# EasyEDA Pro project 各种板子.eprj

# Schematic Schematic1
Create Date: 2023-07-29; Page Name: P1; Project Name: 各种板子; Schematic Name: Schematic1; Update Date: 2023-07-30; Company: 嘉立创EDA; Page Size: A4; Version: V1.0
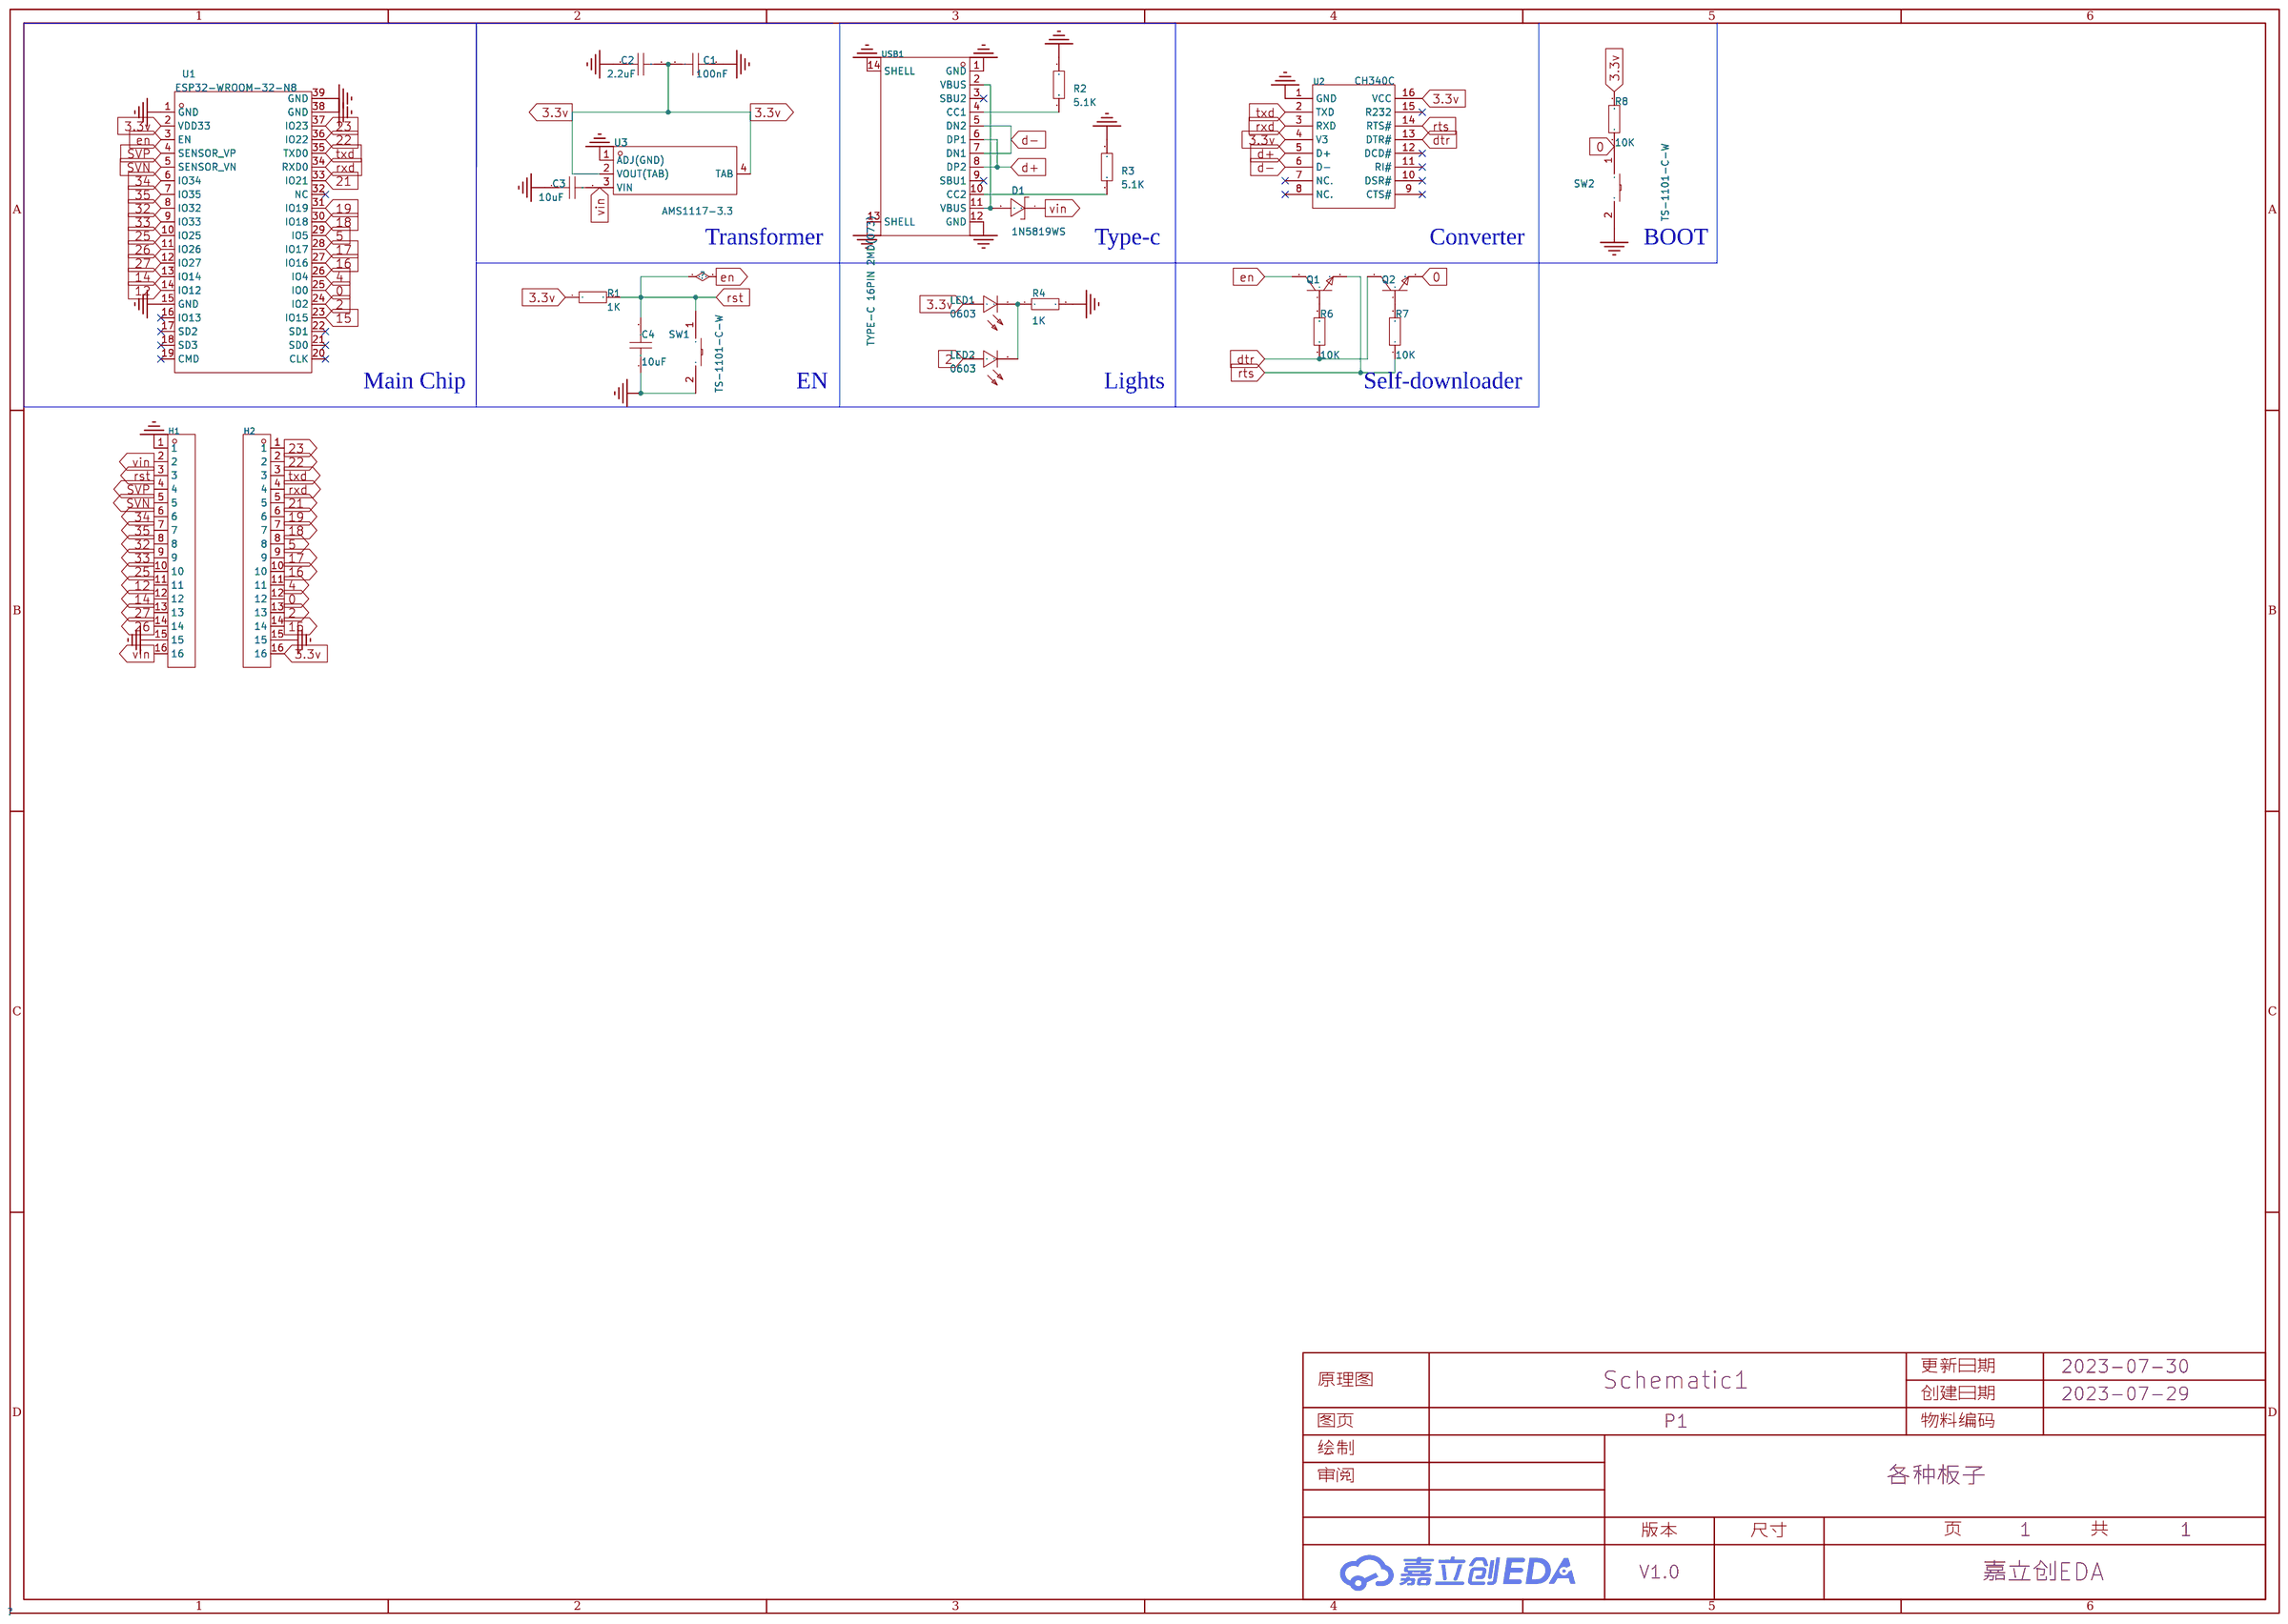
[diagram p0: schematic sheet]

## Parts
C1  100nF  [C0603]
C2  2.2uF  [C0603]
C3  10uF  [C0603]
C4  10uF  [C0603]
D1  1N5819WS  [SOD-323_L1.8-W1.3-LS2.5-RD]
H1  PZ254-1-16-Z-8.5  [HDR-TH_16P-P2.54-V-M]
H2  PZ254-1-16-Z-8.5  [HDR-TH_16P-P2.54-V-M]
LED1  0603  [LED0603-RD_RED]
LED2  0603  [LED0603-RD_RED]
Q1  S8050  [SOT-23-3_L2.9-W1.6-P1.90-LS2.8-BR]
Q2  S8050  [SOT-23-3_L2.9-W1.6-P1.90-LS2.8-BR]
R1  1K  [R0603]
R2  5.1K  [R0603]
R3  5.1K  [R0603]
R4  1K  [R0603]
R6  10K  [R0603]
R7  10K  [R0603]
R8  10K  [R0603]
SW1  TS-1101-C-W  [SW-SMD_L6.0-W3.3-LS8.0]
SW2  TS-1101-C-W  [SW-SMD_L6.0-W3.3-LS8.0]
U1  ESP32-WROOM-32-N8  [WIFIM-SMD_39P-L25.5-W18.0-P1.27]
U2  CH340C  [SOP-16_L10.0-W3.9-P1.27-LS6.0-BL]
U3  AMS1117-3.3  [SOT-223-4_L6.5-W3.5-P2.30-LS7.0-BR]
USB1  TYPE-C 16PIN 2MD(073)  [USB-C-SMD_TYPE-C-6PIN-2MD-073]

## Library data of the parts
C1-C4 = CAP_0603: Supplier Footprint: 0603
D1 = 1N5819WS_C191023: 直流反向耐压(Vr):40V;平均整流电流(Io):1A;正向压降(Vf):600mV@1A;; LCSC Part Name: 40V 1A 600mV@1A; Supplier Part: C191023; Manufacturer: Hottech(合科泰); Supplier Footprint: SOD-323; JLCPCB Part Class: 基础库; Datasheet: https://atta.szlcsc.com/upload/public/pdf/source/20220428/3CB86FD8D28D653594B4E35F9D5AEFD9.pdf; Supplier: LCSC; Reverse Voltage (Vr): 40V; Average Rectified Current (Io): 1A; Forward Voltage (Vf@If): 600mV@1A
H1 H2 = PZ254-1-16-Z-8.5_C2894939: 排数:单排;总PIN位数:16;间距:2.54mm;插针结构:1x16P;行距:-;安装类型:直插;圆针/方针:方针;额定电流:3A;额定电压:-;配合针长度:6mm;塑高:2.5mm;端接针长度:3mm;触头材质:-;工作温度范围:-40℃~+105℃;颜色:黑色;; LCSC Part Name: 2.54mm 1x16P 直插 方针; Supplier Part: C2894939; Manufacturer: HCTL(华灿天禄); Supplier Footprint: 直插,P=2.54mm; JLCPCB Part Class: 扩展库; Supplier: LCSC; Number of Rows: 单排; Number of Pins: 16; Pitch: 2.54mm; Pin Structure: 1x16P; Mounting Type: 直插; Circluar Pins/Square Pins: 方针; Current Rating (Max): 3A; Length of Mating Pin: 6mm; Insulation Height: 2.5mm; Length of End Connection Pin: 3mm; Operating Temperature Range: -40℃~+105℃; Color: 黑色
LED1 LED2 = NCD0603R1_C84263: 发光颜色:红灯;; LCSC Part Name: 红灯; Supplier Part: C84263; Manufacturer: 国星光电; JLCPCB Part Class: 扩展库; Datasheet: https://atta.szlcsc.com/upload/public/pdf/source/20200820/C84263_DABC6A75E58F576973B407FDBA283D60.pdf; Supplier: LCSC; Emitted Color: 红灯
Q1 Q2 = S8050_C105433: 晶体管类型:NPN;集射极击穿电压(Vceo):25V;集电极电流(Ic):500mA;功率(Pd):300mW;直流电流增益(hFE@Ic,Vce):120@50mA,1V;; LCSC Part Name: NPN 25V 500mA L档 120-200; Supplier Part: C105433; Manufacturer: CJ(江苏长电/长晶); Supplier Footprint: SOT-23; JLCPCB Part Class: 扩展库; Datasheet: https://atta.szlcsc.com/upload/public/pdf/source/20170415/1492237762328.pdf; Supplier: LCSC; Transistor Type: NPN; Collector-Emitter Breakdown Voltage (Vceo): 25V; Collector Current (Ic): 500mA; Power Dissipation (Pd): 300mW; Collector Cut-Off Current (Icbo): 100nA; Collector-Emitter Saturation Voltage (VCE(sat)@Ic,Ib): 600mV@500mA,50mA; DC Current Gain (hFE@Ic,Vce): 120@50mA,1V; Transition Frequency (fT): 150MHz; Operating Temperature: +150℃@(Tj)
R1-R4 R6-R8 = Res_0603: Supplier Footprint: 0603
SW1 SW2 = TS-1101-C-W: 触点电流:50mA;额定电压(AC):-;额定电压(DC):12V;额定功率:-;绝缘电阻:-;电路结构:单刀单掷;安装方式:立贴;带灯:无;作用力:260gf;机械寿命:5万次;带支架:否;; LCSC Part Name: 立贴 6*3.6*2.5mm 轻触开关 一型3*6*2.5有白ZD b拉伸白色带淡绿按键 卷装; Supplier Part: C318938; Manufacturer: XKB Connectivity(中国星坤); Supplier Footprint: SMD; JLCPCB Part Class: 扩展库; Datasheet: https://atta.szlcsc.com/upload/public/pdf/source/20200227/C318938_C2E53B1EEDE37D980A33616AC086DE53.pdf; Supplier: LCSC; Contact Current: 50mA; Voltage Rating (DC): 12V; Circuit: 单刀单掷; Mounting Style: 立贴; Actuator Style: 矩形按钮; Actuator/Cap Color: 白色带淡绿; With Lamp: 无; Operating Force: 260gf; Mechanical Life: 5万次; Operating Temperature: -30℃~+85℃; Switch Length: 6mm; Switch Width: 3.6mm; Switch Height: 2.5mm; Strike Gundam: 否
U1 = ESP32-WROOM-32-N8: Supplier Part: C529582; Manufacturer: ESPRESSIF(乐鑫); Supplier Footprint: SMD,18x25.5mm; JLCPCB Part Class: 扩展库; Datasheet: https://atta.szlcsc.com/upload/public/pdf/source/20200521/C529581_8F7B9F041ADB7CF235FBC8D159B9C4FF.pdf; Supplier: LCSC
U2 = CH340C: 应用功能:收发器;接口协议:USB 2.0;数据速率:2Mbps;; LCSC Part Name: CH340C USB转串口芯片 CH340; Supplier Part: C84681; Manufacturer: WCH(南京沁恒); Supplier Footprint: SOP-16; JLCPCB Part Class: 扩展库; Datasheet: https://atta.szlcsc.com/upload/public/pdf/source/20200819/C84681_ADBED554CE321879DBD6B1D06488689C.pdf; Supplier: LCSC; Applications Function: 收发器; Protocol: USB 2.0; Data Rate: 2Mbps; Supply Voltage: 3.3V；5V
U3 = AMS1117-3.3_C347222: 输出类型:固定;输出极性:正;最大输入电压:18V;输出电压:3.3V;输出电流:1A;电源纹波抑制比(PSRR):60dB@(120Hz);; Supplier Part: C347222; Manufacturer: UMW(广东友台半导体); Supplier Footprint: SOT-223; JLCPCB Part Class: 扩展库; Datasheet: https://atta.szlcsc.com/upload/public/pdf/source/20211011/50CC665C22E3A66C08379A4A74BDA25C.pdf; Supplier: LCSC; Output Type: 固定; Output Polarity: 正; Number of Outputs: 1; Maximum Input Voltage: 18V; Output Voltage: 3.3V; Dropout Voltage: 1.3V@(1A); Output Current: 1A; Power Supply Rejection Ratio (PSRR): 60dB@(120Hz)
USB1 = TYPE-C 16PIN 2MD(073): 连接器类型:Type-C;标准:-;公母:母座;触点数量:16;端口数量:1;安装方式:卧贴;额定电流 - 电源:5A;工作温度范围:-25℃~+85℃;; LCSC Part Name: TYPE-C母座 16P 4脚插件带定位柱 不锈钢外壳 2次模顶; Supplier Part: C2765186; Manufacturer: SHOU HAN(首韩); Supplier Footprint: SMD; JLCPCB Part Class: 扩展库; Supplier: LCSC; Connector Type: Type-C; Gender: 母座; Number of Contacts: 16; Number of Ports: 1; Mounting Style: 卧贴; Current Rating - Power (Max): 5A; Operating Temperature Range: -25℃~+85℃

## Nets
3.3v: C1.2 C2.1 H2.16 LED1.2(A) R1.1 R8.2 U1.2(VDD33) U2.4(V3) U2.16(VCC) U3.2(VOUT(TAB)) U3.4(TAB)
GND: C1.1 C2.2 C3.1 C4.1 H1.1 H1.15 H2.15 R2.1 R3.1 R4.2 SW1.2 SW2.2 U1.1(GND) U1.15(GND) U1.38(GND) U1.39(GND) U2.1(GND) U3.1(ADJ(GND)) USB1.1(GND) USB1.12(GND) USB1.13(SHELL) USB1.14(SHELL)
vin: C3.2 D1.1(C) H1.2 H1.16 U3.3(VIN)
0: H2.12 Q2.2 R8.1 SW2.1 U1.25(IO0)
2: H2.13 LED2.2(A) U1.24(IO2)
4: H2.11 U1.26(IO4)
5: H2.8 U1.29(IO5)
12: H1.11 U1.14(IO12)
14: H1.12 U1.13(IO14)
15: H2.14 U1.23(IO15)
16: H2.10 U1.27(IO16)
17: H2.9 U1.28(IO17)
18: H2.7 U1.30(IO18)
19: H2.6 U1.31(IO19)
21: H2.5 U1.33(IO21)
22: H2.2 U1.36(IO22)
23: H2.1 U1.37(IO23)
25: H1.10 U1.10(IO25)
26: H1.14 U1.11(IO26)
27: H1.13 U1.12(IO27)
32: H1.8 U1.8(IO32)
33: H1.9 U1.9(IO33)
34: H1.6 U1.6(IO34)
35: H1.7 U1.7(IO35)
d+: U2.5(D+) USB1.6(DP1) USB1.8(DP2)
d-: U2.6(D-) USB1.5(DN2) USB1.7(DN1)
dtr: Q2.3 R6.1 U2.13(DTR#)
en: C4.2 H1.3 Q1.3 R1.2 SW1.1 U1.3(EN)
rts: Q1.2 R7.1 U2.14(RTS#)
rxd: H2.4 U1.34(RXD0) U2.3(RXD)
SVN: H1.5 U1.5(SENSOR_VN)
SVP: H1.4 U1.4(SENSOR_VP)
txd: H2.3 U1.35(TXD0) U2.2(TXD)
$1N2818: R2.2 USB1.4(CC1)
$1N3069: D1.2(A) USB1.2(VBUS) USB1.11(VBUS)
$1N3084: R3.2 USB1.10(CC2)
$1N3978: Q2.1 R7.2
$1N4007: Q1.1 R6.2
$1N5108: LED1.1(K) LED2.1(K) R4.1

Not connected (* = marked no-connect by the designer): U1 16(IO13)* 17(SD2)* 18(SD3)* 19(CMD)* 20(CLK)* 21(SD0)* 22(SD1)* 32(NC)*; U2 7(NC.)* 8(NC.)* 9(CTS#)* 10(DSR#)* 11(RI#)* 12(DCD#)* 15(R232)*; USB1 3(SBU2)* 9(SBU1)*

## Notes on the sheet
- Transformer
- Type-c
- Converter
- BOOT
- Main Chip
- EN
- Lights
- Self-downloader

# Schematic Schematic2
Create Date: 2023-07-29; Page Name: P1; Project Name: 各种板子; Schematic Name: Schematic2; Update Date: 2023-07-30; Company: 嘉立创EDA; Page Size: A4; Version: V1.0
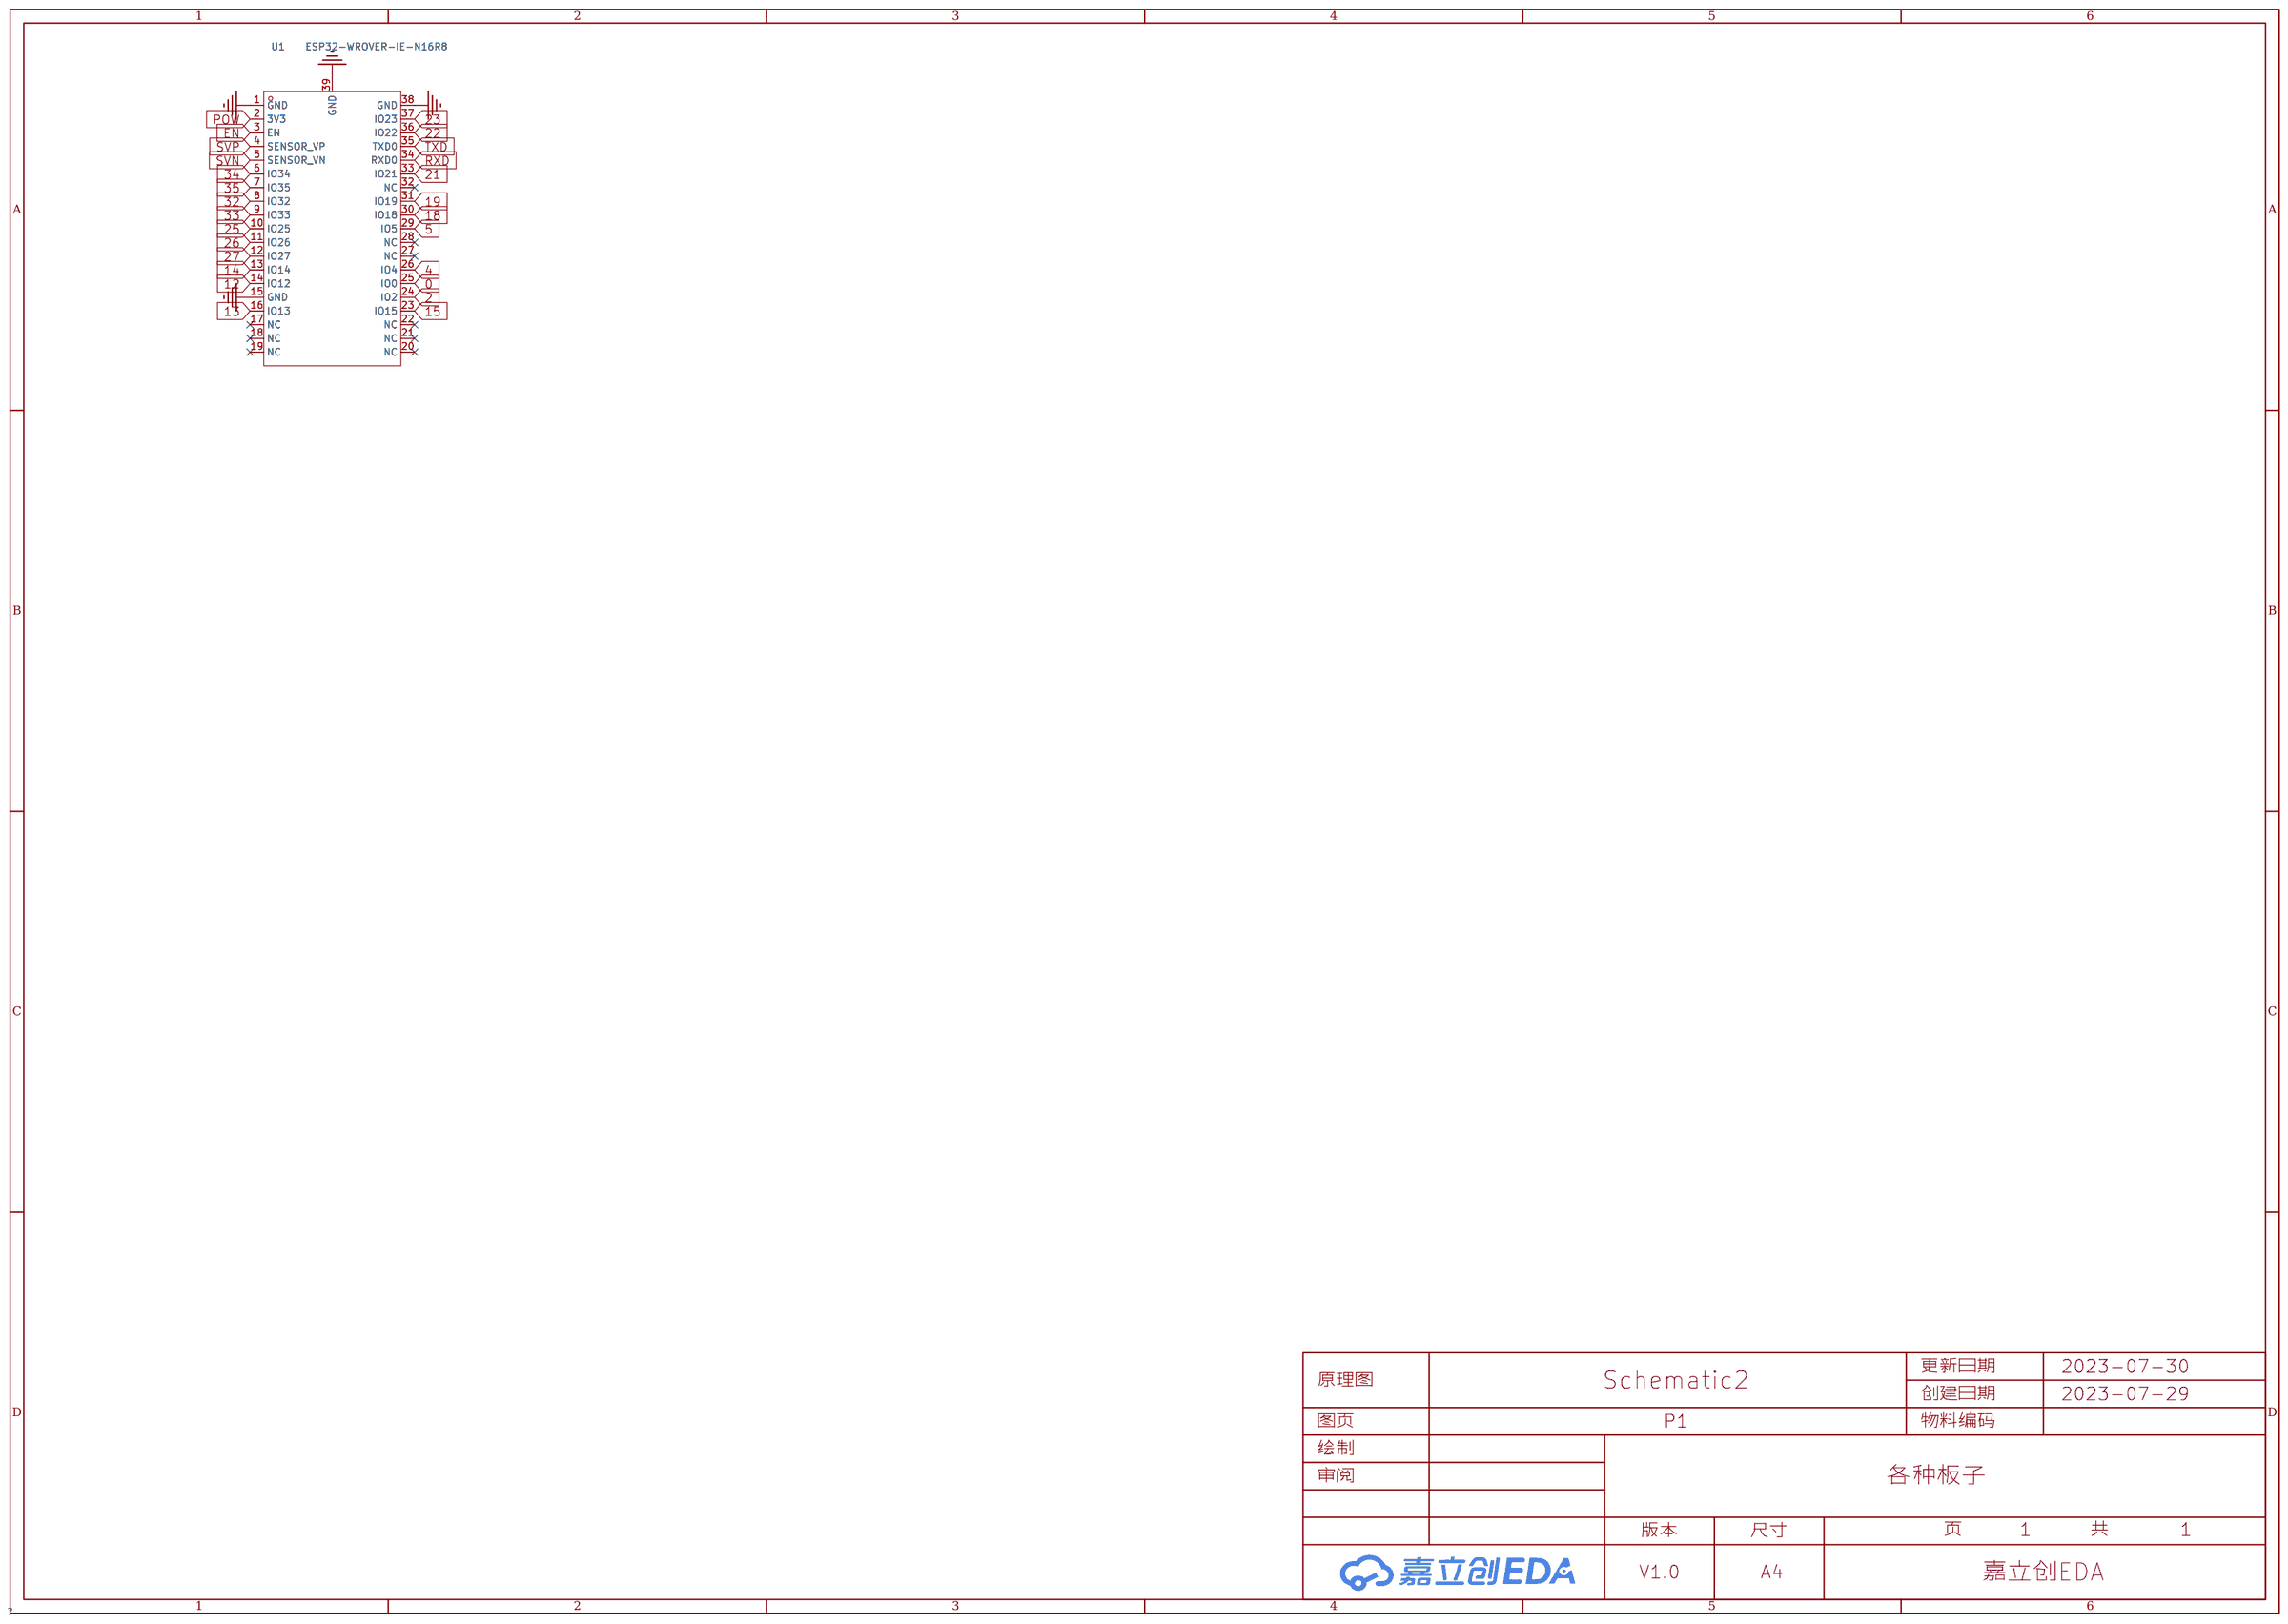
[diagram p1: schematic sheet]

## Parts
U1  ESP32-WROVER-IE-N16R8  [WIFI-SMD_ESP32-WROVER-E]

## Library data of the parts
U1 = ESP32-WROVER-IE-N16R8_C701352: ESP32-WROVER-IE 集成 ESP32-D0WD-V3 芯片 18x31.4x3.3; LCSC Part Name: WIFI模块 外接天线IPEX模组; Supplier Part: C701352; Manufacturer: ESPRESSIF(乐鑫); Supplier Footprint: SMD-38P; JLCPCB Part Class: 扩展库; Datasheet: https://atta.szlcsc.com/upload/public/pdf/source/20200730/C701352_037A60005F1BF393F126A44EB320B018.pdf; Supplier: LCSC

## Nets
GND: U1.1(GND) U1.15(GND) U1.38(GND) U1.39(GND)
0: U1.25(IO0)
2: U1.24(IO2)
4: U1.26(IO4)
5: U1.29(IO5)
12: U1.14(IO12)
13: U1.16(IO13)
14: U1.13(IO14)
15: U1.23(IO15)
18: U1.30(IO18)
19: U1.31(IO19)
21: U1.33(IO21)
22: U1.36(IO22)
23: U1.37(IO23)
25: U1.10(IO25)
26: U1.11(IO26)
27: U1.12(IO27)
32: U1.8(IO32)
33: U1.9(IO33)
34: U1.6(IO34)
35: U1.7(IO35)
EN: U1.3(EN)
POW: U1.2(3V3)
RXD: U1.34(RXD0)
SVN: U1.5(SENSOR_VN)
SVP: U1.4(SENSOR_VP)
TXD: U1.35(TXD0)

Not connected (* = marked no-connect by the designer): U1 17(NC)* 18(NC)* 19(NC)* 20(NC)* 21(NC)* 22(NC)* 27(NC)* 28(NC)* 32(NC)*

# Schematic Schematic1_1
Create Date: 2023-07-29; Page Name: P1; Project Name: 各种板子; Schematic Name: Schematic1; Update Date: 2023-07-30; Company: 嘉立创EDA; Page Size: A4; Version: V1.0
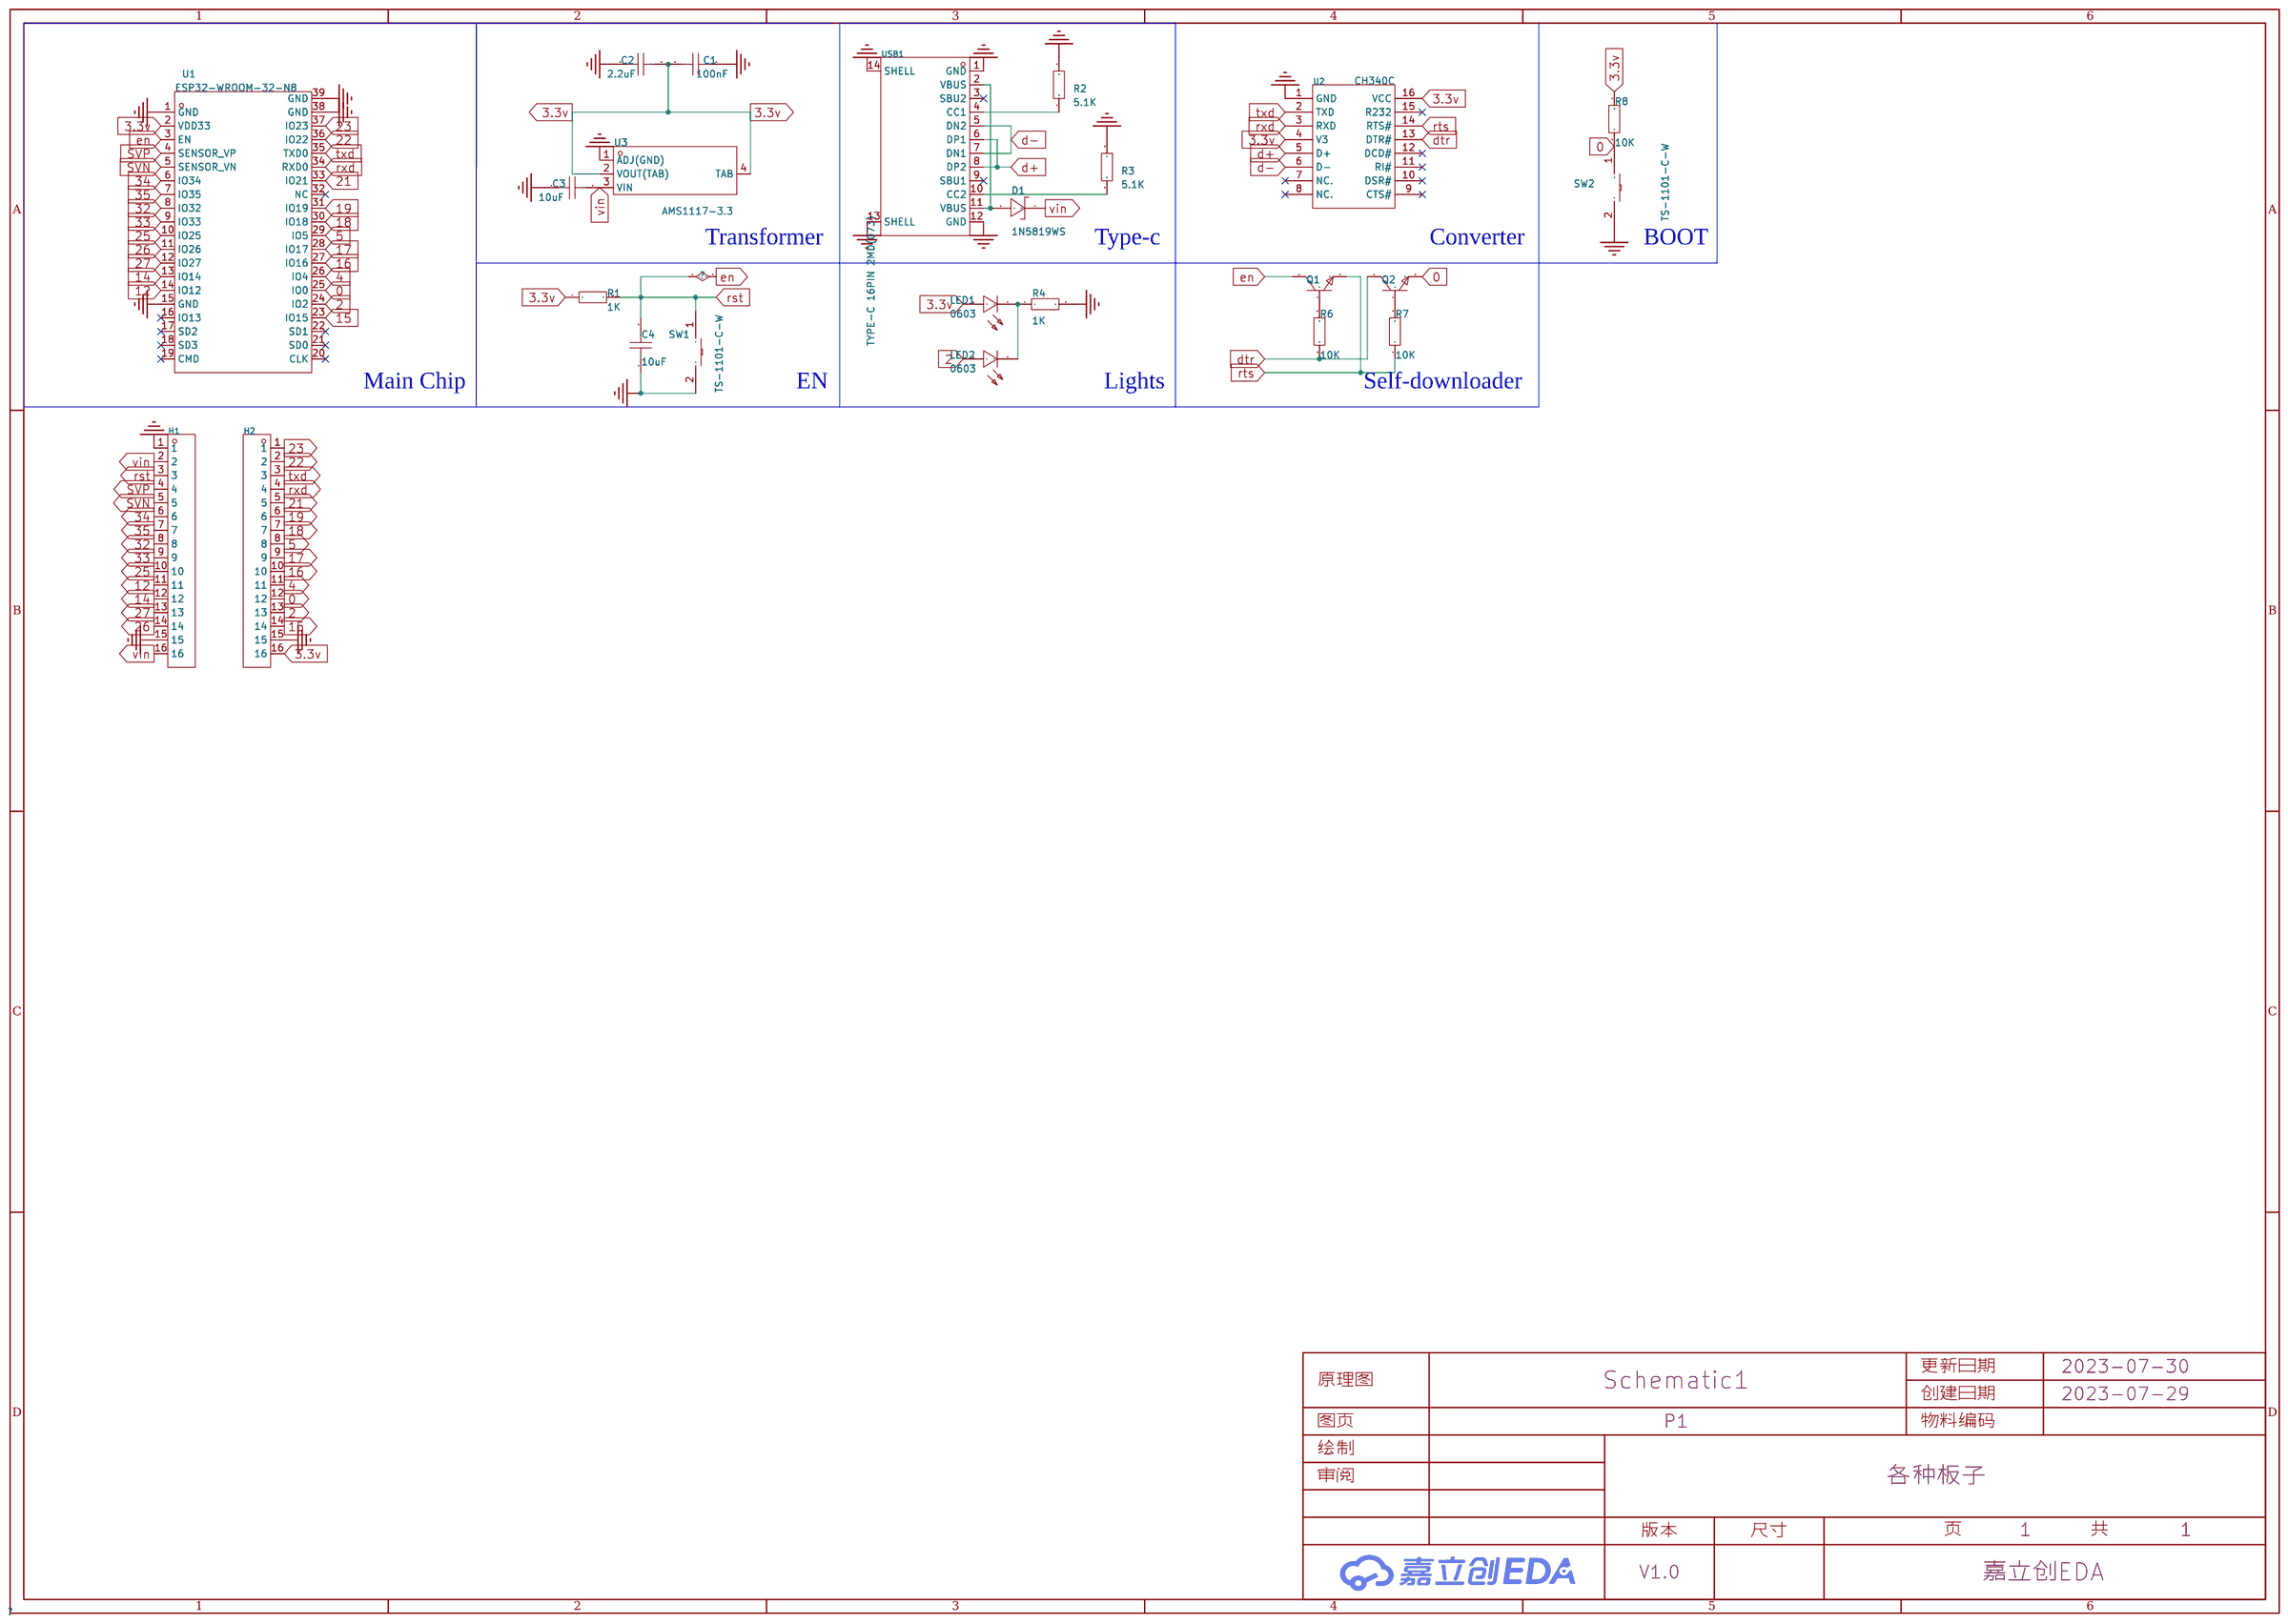
[diagram p2: schematic sheet]

## Parts
C1  100nF  [C0603]
C2  2.2uF  [C0603]
C3  10uF  [C0603]
C4  10uF  [C0603]
D1  1N5819WS  [SOD-323_L1.8-W1.3-LS2.5-RD]
H1  PZ254-1-16-Z-8.5  [HDR-TH_16P-P2.54-V-M]
H2  PZ254-1-16-Z-8.5  [HDR-TH_16P-P2.54-V-M]
LED1  0603  [LED0603-RD_RED]
LED2  0603  [LED0603-RD_RED]
Q1  S8050  [SOT-23-3_L2.9-W1.6-P1.90-LS2.8-BR]
Q2  S8050  [SOT-23-3_L2.9-W1.6-P1.90-LS2.8-BR]
R1  1K  [R0603]
R2  5.1K  [R0603]
R3  5.1K  [R0603]
R4  1K  [R0603]
R6  10K  [R0603]
R7  10K  [R0603]
R8  10K  [R0603]
SW1  TS-1101-C-W  [SW-SMD_L6.0-W3.3-LS8.0]
SW2  TS-1101-C-W  [SW-SMD_L6.0-W3.3-LS8.0]
U1  ESP32-WROOM-32-N8  [WIFIM-SMD_39P-L25.5-W18.0-P1.27]
U2  CH340C  [SOP-16_L10.0-W3.9-P1.27-LS6.0-BL]
U3  AMS1117-3.3  [SOT-223-4_L6.5-W3.5-P2.30-LS7.0-BR]
USB1  TYPE-C 16PIN 2MD(073)  [USB-C-SMD_TYPE-C-6PIN-2MD-073]

## Library data of the parts
C1-C4 = CAP_0603: Supplier Footprint: 0603
D1 = 1N5819WS_C191023: 直流反向耐压(Vr):40V;平均整流电流(Io):1A;正向压降(Vf):600mV@1A;; LCSC Part Name: 40V 1A 600mV@1A; Supplier Part: C191023; Manufacturer: Hottech(合科泰); Supplier Footprint: SOD-323; JLCPCB Part Class: 基础库; Datasheet: https://atta.szlcsc.com/upload/public/pdf/source/20220428/3CB86FD8D28D653594B4E35F9D5AEFD9.pdf; Supplier: LCSC; Reverse Voltage (Vr): 40V; Average Rectified Current (Io): 1A; Forward Voltage (Vf@If): 600mV@1A
H1 H2 = PZ254-1-16-Z-8.5_C2894939: 排数:单排;总PIN位数:16;间距:2.54mm;插针结构:1x16P;行距:-;安装类型:直插;圆针/方针:方针;额定电流:3A;额定电压:-;配合针长度:6mm;塑高:2.5mm;端接针长度:3mm;触头材质:-;工作温度范围:-40℃~+105℃;颜色:黑色;; LCSC Part Name: 2.54mm 1x16P 直插 方针; Supplier Part: C2894939; Manufacturer: HCTL(华灿天禄); Supplier Footprint: 直插,P=2.54mm; JLCPCB Part Class: 扩展库; Supplier: LCSC; Number of Rows: 单排; Number of Pins: 16; Pitch: 2.54mm; Pin Structure: 1x16P; Mounting Type: 直插; Circluar Pins/Square Pins: 方针; Current Rating (Max): 3A; Length of Mating Pin: 6mm; Insulation Height: 2.5mm; Length of End Connection Pin: 3mm; Operating Temperature Range: -40℃~+105℃; Color: 黑色
LED1 LED2 = NCD0603R1_C84263: 发光颜色:红灯;; LCSC Part Name: 红灯; Supplier Part: C84263; Manufacturer: 国星光电; JLCPCB Part Class: 扩展库; Datasheet: https://atta.szlcsc.com/upload/public/pdf/source/20200820/C84263_DABC6A75E58F576973B407FDBA283D60.pdf; Supplier: LCSC; Emitted Color: 红灯
Q1 Q2 = S8050_C105433: 晶体管类型:NPN;集射极击穿电压(Vceo):25V;集电极电流(Ic):500mA;功率(Pd):300mW;直流电流增益(hFE@Ic,Vce):120@50mA,1V;; LCSC Part Name: NPN 25V 500mA L档 120-200; Supplier Part: C105433; Manufacturer: CJ(江苏长电/长晶); Supplier Footprint: SOT-23; JLCPCB Part Class: 扩展库; Datasheet: https://atta.szlcsc.com/upload/public/pdf/source/20170415/1492237762328.pdf; Supplier: LCSC; Transistor Type: NPN; Collector-Emitter Breakdown Voltage (Vceo): 25V; Collector Current (Ic): 500mA; Power Dissipation (Pd): 300mW; Collector Cut-Off Current (Icbo): 100nA; Collector-Emitter Saturation Voltage (VCE(sat)@Ic,Ib): 600mV@500mA,50mA; DC Current Gain (hFE@Ic,Vce): 120@50mA,1V; Transition Frequency (fT): 150MHz; Operating Temperature: +150℃@(Tj)
R1-R4 R6-R8 = Res_0603: Supplier Footprint: 0603
SW1 SW2 = TS-1101-C-W: 触点电流:50mA;额定电压(AC):-;额定电压(DC):12V;额定功率:-;绝缘电阻:-;电路结构:单刀单掷;安装方式:立贴;带灯:无;作用力:260gf;机械寿命:5万次;带支架:否;; LCSC Part Name: 立贴 6*3.6*2.5mm 轻触开关 一型3*6*2.5有白ZD b拉伸白色带淡绿按键 卷装; Supplier Part: C318938; Manufacturer: XKB Connectivity(中国星坤); Supplier Footprint: SMD; JLCPCB Part Class: 扩展库; Datasheet: https://atta.szlcsc.com/upload/public/pdf/source/20200227/C318938_C2E53B1EEDE37D980A33616AC086DE53.pdf; Supplier: LCSC; Contact Current: 50mA; Voltage Rating (DC): 12V; Circuit: 单刀单掷; Mounting Style: 立贴; Actuator Style: 矩形按钮; Actuator/Cap Color: 白色带淡绿; With Lamp: 无; Operating Force: 260gf; Mechanical Life: 5万次; Operating Temperature: -30℃~+85℃; Switch Length: 6mm; Switch Width: 3.6mm; Switch Height: 2.5mm; Strike Gundam: 否
U1 = ESP32-WROOM-32-N8: Supplier Part: C529582; Manufacturer: ESPRESSIF(乐鑫); Supplier Footprint: SMD,18x25.5mm; JLCPCB Part Class: 扩展库; Datasheet: https://atta.szlcsc.com/upload/public/pdf/source/20200521/C529581_8F7B9F041ADB7CF235FBC8D159B9C4FF.pdf; Supplier: LCSC
U2 = CH340C: 应用功能:收发器;接口协议:USB 2.0;数据速率:2Mbps;; LCSC Part Name: CH340C USB转串口芯片 CH340; Supplier Part: C84681; Manufacturer: WCH(南京沁恒); Supplier Footprint: SOP-16; JLCPCB Part Class: 扩展库; Datasheet: https://atta.szlcsc.com/upload/public/pdf/source/20200819/C84681_ADBED554CE321879DBD6B1D06488689C.pdf; Supplier: LCSC; Applications Function: 收发器; Protocol: USB 2.0; Data Rate: 2Mbps; Supply Voltage: 3.3V；5V
U3 = AMS1117-3.3_C347222: 输出类型:固定;输出极性:正;最大输入电压:18V;输出电压:3.3V;输出电流:1A;电源纹波抑制比(PSRR):60dB@(120Hz);; Supplier Part: C347222; Manufacturer: UMW(广东友台半导体); Supplier Footprint: SOT-223; JLCPCB Part Class: 扩展库; Datasheet: https://atta.szlcsc.com/upload/public/pdf/source/20211011/50CC665C22E3A66C08379A4A74BDA25C.pdf; Supplier: LCSC; Output Type: 固定; Output Polarity: 正; Number of Outputs: 1; Maximum Input Voltage: 18V; Output Voltage: 3.3V; Dropout Voltage: 1.3V@(1A); Output Current: 1A; Power Supply Rejection Ratio (PSRR): 60dB@(120Hz)
USB1 = TYPE-C 16PIN 2MD(073): 连接器类型:Type-C;标准:-;公母:母座;触点数量:16;端口数量:1;安装方式:卧贴;额定电流 - 电源:5A;工作温度范围:-25℃~+85℃;; LCSC Part Name: TYPE-C母座 16P 4脚插件带定位柱 不锈钢外壳 2次模顶; Supplier Part: C2765186; Manufacturer: SHOU HAN(首韩); Supplier Footprint: SMD; JLCPCB Part Class: 扩展库; Supplier: LCSC; Connector Type: Type-C; Gender: 母座; Number of Contacts: 16; Number of Ports: 1; Mounting Style: 卧贴; Current Rating - Power (Max): 5A; Operating Temperature Range: -25℃~+85℃

## Nets
3.3v: C1.2 C2.1 H2.16 LED1.2(A) R1.1 R8.2 U1.2(VDD33) U2.4(V3) U2.16(VCC) U3.2(VOUT(TAB)) U3.4(TAB)
GND: C1.1 C2.2 C3.1 C4.1 H1.1 H1.15 H2.15 R2.1 R3.1 R4.2 SW1.2 SW2.2 U1.1(GND) U1.15(GND) U1.38(GND) U1.39(GND) U2.1(GND) U3.1(ADJ(GND)) USB1.1(GND) USB1.12(GND) USB1.13(SHELL) USB1.14(SHELL)
vin: C3.2 D1.1(C) H1.2 H1.16 U3.3(VIN)
0: H2.12 Q2.2 R8.1 SW2.1 U1.25(IO0)
2: H2.13 LED2.2(A) U1.24(IO2)
4: H2.11 U1.26(IO4)
5: H2.8 U1.29(IO5)
12: H1.11 U1.14(IO12)
14: H1.12 U1.13(IO14)
15: H2.14 U1.23(IO15)
16: H2.10 U1.27(IO16)
17: H2.9 U1.28(IO17)
18: H2.7 U1.30(IO18)
19: H2.6 U1.31(IO19)
21: H2.5 U1.33(IO21)
22: H2.2 U1.36(IO22)
23: H2.1 U1.37(IO23)
25: H1.10 U1.10(IO25)
26: H1.14 U1.11(IO26)
27: H1.13 U1.12(IO27)
32: H1.8 U1.8(IO32)
33: H1.9 U1.9(IO33)
34: H1.6 U1.6(IO34)
35: H1.7 U1.7(IO35)
d+: U2.5(D+) USB1.6(DP1) USB1.8(DP2)
d-: U2.6(D-) USB1.5(DN2) USB1.7(DN1)
dtr: Q2.3 R6.1 U2.13(DTR#)
en: C4.2 H1.3 Q1.3 R1.2 SW1.1 U1.3(EN)
rts: Q1.2 R7.1 U2.14(RTS#)
rxd: H2.4 U1.34(RXD0) U2.3(RXD)
SVN: H1.5 U1.5(SENSOR_VN)
SVP: H1.4 U1.4(SENSOR_VP)
txd: H2.3 U1.35(TXD0) U2.2(TXD)
$1N2818: R2.2 USB1.4(CC1)
$1N3069: D1.2(A) USB1.2(VBUS) USB1.11(VBUS)
$1N3084: R3.2 USB1.10(CC2)
$1N3978: Q2.1 R7.2
$1N4007: Q1.1 R6.2
$1N5108: LED1.1(K) LED2.1(K) R4.1

Not connected (* = marked no-connect by the designer): U1 16(IO13)* 17(SD2)* 18(SD3)* 19(CMD)* 20(CLK)* 21(SD0)* 22(SD1)* 32(NC)*; U2 7(NC.)* 8(NC.)* 9(CTS#)* 10(DSR#)* 11(RI#)* 12(DCD#)* 15(R232)*; USB1 3(SBU2)* 9(SBU1)*

## Notes on the sheet
- Transformer
- Type-c
- Converter
- BOOT
- Main Chip
- EN
- Lights
- Self-downloader

# Board PCB1
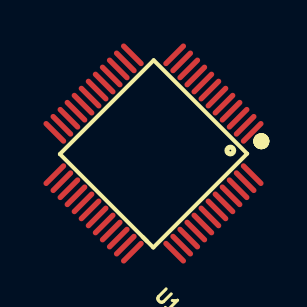
[diagram p3: board, top side]
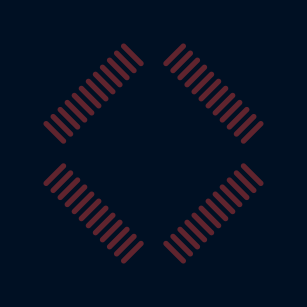
[diagram p4: board, bottom side, seen from below]

No outline. copper layers: Top Layer, Inner9, Inner10, Inner11, Inner12, Inner13, Inner14, Inner15, Inner16, Inner17, Inner18, Inner19, Inner20, Inner21, Inner22, Inner23, Inner24, Inner25, Inner26, Inner27, Inner28, Inner29, Inner30, Bottom Layer. Coordinates in mm from the lowest, leftmost part position.
Stack: Top Layer 0.035mm / Dielectric1 1.51mm FR4 er 4.5 / Bottom Layer 0.035mm

## Design rules (mm)
template: JLCPCB Capability(Two Layers Board)
spacing copperThickness1oz (default): track to track 0.102, other pairs 0.152 to 0.3
spacing copperThickness2oz: track to track 0.203, other pairs 0.152 to 0.3
track width copperThickness1oz (default): min 0.127, default 0.254, max 2.54
track width copperThickness2oz: min 0.203, default 0.254, max 2.54
differential pair differentialPair (default): width min 0.127, default 0.254, max 2.54; gap min 0.152, default 0.152
via viaSize (default): diameter min 0.5, default 0.61, max 10; hole min 0.3, default 0.305, max 6.3

## Placement (name value [footprint] x y rotation side)
U1  STM32F103C8T6  [LQFP-48_L7.0-W7.0-P0.50-LS9.0-BL]  0 0 135 top

## Footprints (pads in the part's own frame, mm; a bottom-side part is the same pattern mirrored in y, then rotated)
LQFP-48_L7.0-W7.0-P0.50-LS9.0-BL
  oval 0.27x1.5 smd: 1(-2.75,-4.25) 2(-2.25,-4.25) 3(-1.75,-4.25) 4(-1.25,-4.25) 5(-0.75,-4.25) 6(-0.25,-4.25) 7(0.25,-4.25) 8(0.75,-4.25) 9(1.25,-4.25) 10(1.75,-4.25) 11(2.25,-4.25) 12(2.75,-4.25) 25(2.75,4.25) 26(2.25,4.25) 27(1.75,4.25) 28(1.25,4.25) 29(0.75,4.25) 30(0.25,4.25) 31(-0.25,4.25) 32(-0.75,4.25) 33(-1.25,4.25) 34(-1.75,4.25) 35(-2.25,4.25) 36(-2.75,4.25)
  oval 1.5x0.27 smd: 13(4.25,-2.75) 14(4.25,-2.25) 15(4.25,-1.75) 16(4.25,-1.25) 17(4.25,-0.75) 18(4.25,-0.25) 19(4.25,0.25) 20(4.25,0.75) 21(4.25,1.25) 22(4.25,1.75) 23(4.25,2.25) 24(4.25,2.75) 37(-4.25,2.75) 38(-4.25,2.25) 39(-4.25,1.75) 40(-4.25,1.25) 41(-4.25,0.75) 42(-4.25,0.25) 43(-4.25,-0.25) 44(-4.25,-0.75) 45(-4.25,-1.25) 46(-4.25,-1.75) 47(-4.25,-2.25) 48(-4.25,-2.75)

## Nets

Pads without a net: U1 1 2 3 4 5 6 7 8 9 10 11 12 13 14 15 16 17 18 19 20 21 22 23 24 25 26 27 28 29 30 31 32 33 34 35 36 37 38 39 40 41 42 43 44 45 46 47 48

# Board PCB2
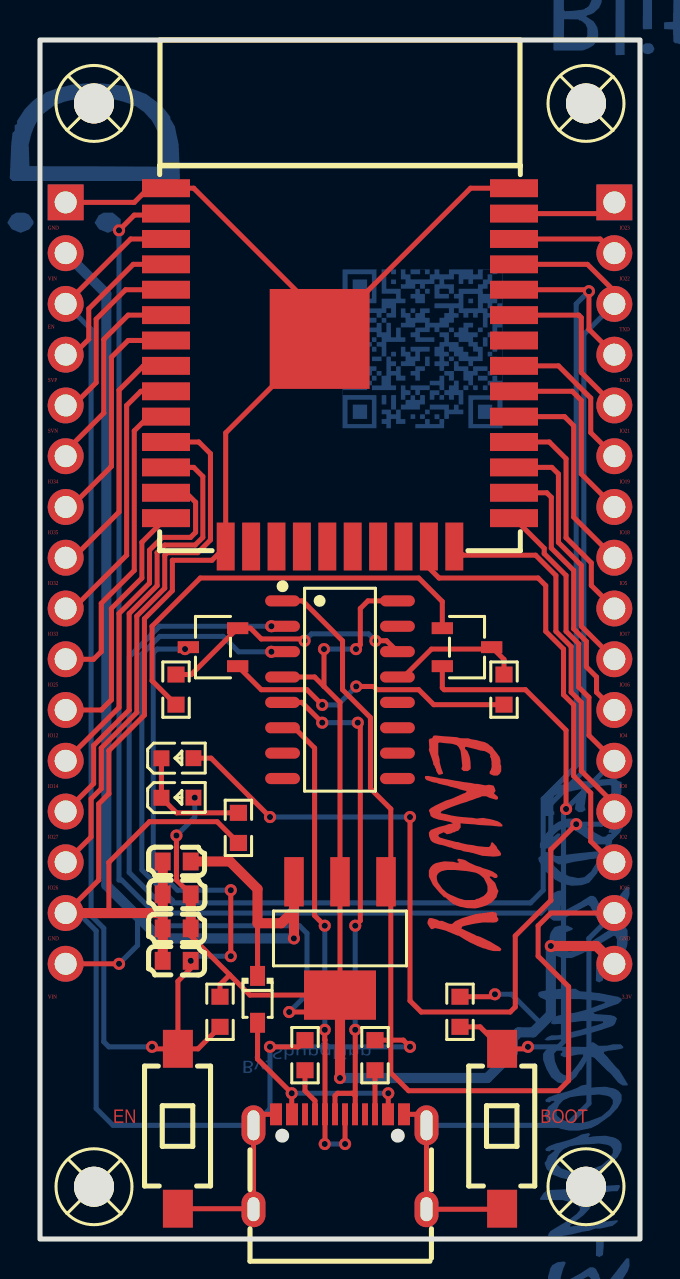
[diagram p5: board, top side]
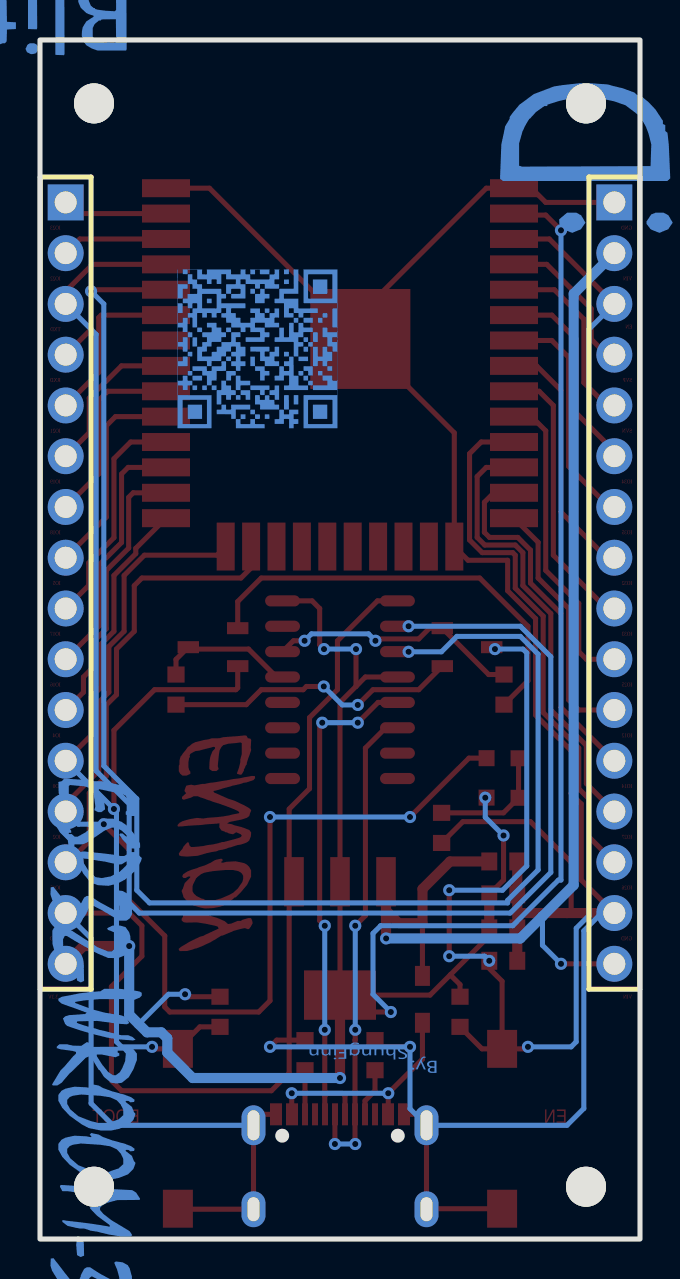
[diagram p6: board, bottom side, seen from below]

Outline 30 x 60 mm; copper layers: Top Layer, Bottom Layer. Coordinates in mm from the lower left corner of the outline.
Outline path: rectangle 0,60 30,0
Stack: Top Layer 0.035mm / Dielectric1 1.51mm FR4 er 4.5 / Bottom Layer 0.035mm

## Design rules (mm)
template: JLCPCB Capability(Two Layers Board)
spacing copperThickness1oz (default): track to track 0.102, other pairs 0.152 to 0.3
spacing copperThickness2oz: track to track 0.203, other pairs 0.152 to 0.3
track width copperThickness1oz (default): min 0.127, default 0.254, max 2.54
track width copperThickness2oz: min 0.203, default 0.254, max 2.54
differential pair differentialPair (default): width min 0.127, default 0.254, max 2.54; gap min 0.152, default 0.152
via viaSize (default): diameter min 0.5, default 0.61, max 10; hole min 0.3, default 0.305, max 6.3

## Placement (name value [footprint] x y rotation side)
C1  100nF  [C0603]  6.84 15.54 0 top
C2  2.2uF  [C0603]  6.84 17.25 180 top
C3  10uF  [C0603]  6.84 18.89 0 top
C4  10uF  [C0603]  6.84 13.92 0 top
D1  1N5819WS  [SOD-323_L1.8-W1.3-LS2.5-RD]  10.88 11.99 270 top
H1  PZ254-1-16-Z-8.5  [HDR-TH_16P-P2.54-V-M]  1.28 32.82 270 bottom
H2  PZ254-1-16-Z-8.5  [HDR-TH_16P-P2.54-V-M]  28.72 32.82 270 bottom
LED1  0603  [LED0603-RD_RED]  6.87 22.08 0 top
LED2  0603  [LED0603-RD_RED]  6.87 24.06 0 top
Q1  S8050  [SOT-23-3_L2.9-W1.6-P1.90-LS2.8-BR]  8.65 29.62 0 top
Q2  S8050  [SOT-23-3_L2.9-W1.6-P1.90-LS2.8-BR]  21.35 29.62 180 top
R1  1K  [R0603]  9 11.37 270 top
R2  5.1K  [R0603]  13.25 9.2 270 top
R3  5.1K  [R0603]  16.75 9.2 270 top
R4  1K  [R0603]  9.92 20.57 270 top
R6  10K  [R0603]  23.2 27.49 270 top
R7  10K  [R0603]  6.8 27.49 270 top
R8  10K  [R0603]  21 11.37 90 top
SW1  TS-1101-C-W  [SW-SMD_L6.0-W3.3-LS8.0]  6.9 5.52 270 top
SW2  TS-1101-C-W  [SW-SMD_L6.0-W3.3-LS8.0]  23.1 5.52 270 top
TP1  -  [M2螺丝]  2.7 2.62 0 top
TP2  -  [M2螺丝]  27.3 2.62 0 top
TP3  -  [M2螺丝]  2.7 56.82 0 top
TP4  -  [M2螺丝]  27.3 56.83 0 top
U1  ESP32-WROOM-32-N8  [WIFIM-SMD_39P-L25.5-W18.0-P1.27]  15 43.62 0 top
U2  CH340C  [SOP-16_L10.0-W3.9-P1.27-LS6.0-BL]  15 27.49 270 top
U3  AMS1117-3.3  [SOT-223-4_L6.5-W3.5-P2.30-LS7.0-BR]  15 15.04 90 top
USB1  TYPE-C 16PIN 2MD(073)  [USB-C-SMD_TYPE-C-6PIN-2MD-073]  15 3.87 0 top

## Footprints (pads in the part's own frame, mm; a bottom-side part is the same pattern mirrored in y, then rotated)
C0603
  rect 0.8x0.9 smd: 1(-0.7,0) 2(0.7,0)
HDR-TH_16P-P2.54-V-M
  rect 1.8x1.8 hole 1.1: 1(-19.05,0)
  round 1.8 hole 1.1: 2(-16.51,0) 3(-13.97,0) 4(-11.43,0) 5(-8.89,0) 6(-6.35,0) 7(-3.81,0) 8(-1.27,0) 9(1.27,0) 10(3.81,0) 11(6.35,0) 12(8.89,0) 13(11.43,0) 14(13.97,0) 15(16.51,0) 16(19.05,0)
LED0603-RD_RED
  rect 0.8x0.8 smd: 1(-0.799,-0.004) 2(0.799,0.004)
M2螺丝
  round 2 hole 2: 1(0,0)
R0603
  rect 0.806x0.864 smd: 1(-0.753,0) 2(0.753,0)
SOD-323_L1.8-W1.3-LS2.5-RD
  rect 1x0.75 smd: 1(-1.173,0) 2(1.173,0)
SOP-16_L10.0-W3.9-P1.27-LS6.0-BL
  oval 0.56x1.745 smd: 1(-4.445,-2.873) 2(-3.175,-2.873) 3(-1.905,-2.873) 4(-0.635,-2.873) 5(0.635,-2.873) 6(1.905,-2.873) 7(3.175,-2.873) 8(4.445,-2.873) 9(4.445,2.873) 10(3.175,2.873) 11(1.905,2.873) 12(0.635,2.873) 13(-0.635,2.873) 14(-1.905,2.873) 15(-3.175,2.873) 16(-4.445,2.873)
SOT-23-3_L2.9-W1.6-P1.90-LS2.8-BR
  rect 1.07x0.6 smd: 1(1.235,-0.95) 2(1.235,0.95) 3(-1.235,0)
SOT-223-4_L6.5-W3.5-P2.30-LS7.0-BR
  rect 2.47x0.98 smd: 1(2.835,-2.3) 2(2.835,0) 3(2.835,2.3)
  rect 2.47x3.6 smd: 4(-2.835,0)
SW-SMD_L6.0-W3.3-LS8.0
  rect 1.9x1.5 smd: 1(-4,0) 2(4,0)
USB-C-SMD_TYPE-C-6PIN-2MD-073
  rect 0.6x1.1 smd: 1(-3.2,2.375) 2(-2.4,2.375) 11(2.4,2.375) 12(3.2,2.375)
  rect 0.3x1.1 smd: 3(-1.75,2.375) 4(-1.25,2.375) 5(-0.75,2.375) 6(-0.25,2.375) 7(0.25,2.375) 8(0.75,2.375) 9(1.25,2.375) 10(1.75,2.375)
  oval 1.2x2 hole 0.6x1.5: 13(-4.325,1.825) 14(4.325,1.825)
  oval 1.2x1.8 hole 0.6x1.2: 13(-4.325,-2.375) 14(4.325,-2.375)
WIFIM-SMD_39P-L25.5-W18.0-P1.27
  rect 2.4x0.9 smd: 1(-8.7,8.965) 2(-8.7,7.695) 3(-8.7,6.425) 4(-8.7,5.155) 5(-8.7,3.885) 6(-8.7,2.615) 7(-8.7,1.345) 8(-8.7,0.075) 9(-8.7,-1.195) 10(-8.7,-2.465) 11(-8.7,-3.735) 12(-8.7,-5.005) 13(-8.7,-6.275) 14(-8.7,-7.545) 25(8.7,-7.545) 26(8.7,-6.275) 27(8.7,-5.005) 28(8.7,-3.735) 29(8.7,-2.465) 30(8.7,-1.195) 31(8.7,0.075) 32(8.7,1.345) 33(8.7,2.615) 34(8.7,3.885) 35(8.7,5.155) 36(8.7,6.425) 37(8.7,7.695) 38(8.7,8.965)
  rect 0.9x2.4 smd: 15(-5.715,-8.965) 16(-4.445,-8.965) 17(-3.175,-8.965) 18(-1.905,-8.965) 19(-0.635,-8.965) 20(0.635,-8.965) 21(1.905,-8.965) 22(3.175,-8.965) 23(4.445,-8.965) 24(5.715,-8.965)
  rect 5x5 smd: 39(-1.017,1.422)

## Nets
3.3V: C1.2 C2.1 H2.16 LED1.2 R1.1 R8.2 U1.2 U2.4 U2.16 U3.2 U3.4
GND: C1.1 C2.2 C3.1 C4.1 H1.1 H1.15 H2.15 R2.1 R3.1 R4.2 SW1.2 SW2.2 U1.1 U1.15 U1.38 U1.39 U2.1 U3.1 USB1.1 USB1.12 USB1.13 USB1.14
VIN: C3.2 D1.1 H1.2 H1.16 U3.3
0: H2.12 Q2.2 R8.1 SW2.1 U1.25
2: H2.13 LED2.2 U1.24
4: H2.11 U1.26
5: H2.8 U1.29
12: H1.11 U1.14
14: H1.12 U1.13
15: H2.14 U1.23
16: H2.10 U1.27
17: H2.9 U1.28
18: H2.7 U1.30
19: H2.6 U1.31
21: H2.5 U1.33
22: H2.2 U1.36
23: H2.1 U1.37
25: H1.10 U1.10
26: H1.14 U1.11
27: H1.13 U1.12
32: H1.8 U1.8
33: H1.9 U1.9
34: H1.6 U1.6
35: H1.7 U1.7
D+: U2.5 USB1.6 USB1.8
D-: U2.6 USB1.5 USB1.7
DTR: Q2.3 R6.1 U2.13
EN: C4.2 H1.3 Q1.3 R1.2 SW1.1 U1.3
RTS: Q1.2 R7.1 U2.14
RXD: H2.4 U1.34 U2.3
SVN: H1.5 U1.5
SVP: H1.4 U1.4
TXD: H2.3 U1.35 U2.2
$1N2818: R2.2 USB1.4
$1N3069: D1.2 USB1.2 USB1.11
$1N3084: R3.2 USB1.10
$1N3978: Q2.1 R7.2
$1N4007: Q1.1 R6.2
$1N5108: LED1.1 LED2.1 R4.1

Pads without a net: TP1 1; TP2 1; TP3 1; TP4 1; U1 16 17 18 19 20 21 22 32; U2 7 8 9 10 11 12 15; USB1 3 9

## Via types
v1: diameter 0.61, hole 0.305, Top Layer to Bottom Layer, 40 vias

## Routing (per net, layer and track width the routed paths; a pad name or vN(x,y) marks a point on that pad's centre or on a via; arc(x,y) is an arc through that point)
3.3V: length 124.2
  Top Layer w0.254: v1(14.2,29.52) 14.2,27.65 ; 14.2,27.65 15,26.85 U3.2 U3.4 ; 14.2,27.65 13.73,28.12 U2.4 ; v1(3.95,50.47) 4.71,51.24 6.22,51.24 U1.2 ; v1(15.8,29.52) 16.02,29.74 16.02,31.55 16.4,31.93 U2.16 ; 21,12.12 22.62,12.12 v1(22.75,12.25) ; U3.4 10.5,12.21 9.49,13.22 ; U3.4 14.15,11.36 v1(12.46,11.36) ; 9.49,13.22 9,12.73 9,12.12 ; 9.49,13.22 7.54,15.17 C1.2 ; v1(6.82,20.19) 6.82,17.96 C2.1
  Top Layer w0.508: v1(25.54,14.66) 27.83,14.66 H2.16 ; v1(15,8.06) 15,12.12 ; C2.1 C1.2
  Bottom Layer w0.254: v1(14.2,29.52) v1(15.8,29.52) ; v1(12.46,11.36) 13.35,12.25 13.35,15.3 12.97,15.68 6.36,15.68 4.08,17.96 3.95,17.96 v1(3.95,50.47) ; v1(6.82,20.19) 7.74,21.11 v1(7.74,22.09) ; v1(22.75,12.25) 23.57,12.25 25.06,10.76
  Bottom Layer w0.508: v1(15,8.06) 22.37,8.06 23.64,9.33 23.64,10.05 23.93,10.34 24.65,10.34 25.54,11.23 v1(25.54,14.66)
GND: length 205
  Top Layer w0.254: 17.54,9.95 17.54,8.31 18.43,7.42 25.92,7.42 26.43,7.93 26.43,12.63 24.91,14.15 24.91,15.68 25.54,16.31 H2.15 ; 17.54,9.95 17.54,9.96 ; 17.54,9.95 17.53,9.95 ; 17.54,9.95 18.16,9.95 v1(18.5,9.62) ; USB1.12 18.78,6.24 USB1.14 USB1.14 23.08,1.49 SW2.2 ; 17.54,9.96 17.54,17.64 U3.1 17.54,18.12 17.54,21.52 16.52,22.53 16.52,26.09 15.13,27.49 15.13,29.93 13.13,31.93 U2.1 ; 17.54,9.96 17.53,9.95 ; v1(11.5,9.62) 12.91,9.62 R2.1 ; U1.39 9.28,40.34 U1.15 8.6,33.96 6.62,33.96 6.62,32.44 5.22,31.04 5.22,26.22 3.44,24.44 3.44,22.28 2.94,21.77 2.94,17.96 H1.15 ; U1.39 13.98,46.28 7.69,52.58 U1.1 5.42,52.58 4.71,51.87 H1.1 ; U1.39 21.53,52.58 U1.38 ; USB1.1 11.22,6.24 USB1.13 USB1.13 10.65,1.52 SW1.2 ; 9.92,19.82 8.86,20.88 5.47,20.88 3.44,18.85 3.44,16.51 3.64,16.31 ; 17.53,9.95 R3.1
  Top Layer w0.508: 6.14,16.33 C2.2 C3.1 ; 6.14,16.33 6.11,16.31 H1.15 ; 6.14,16.33 C1.1 C4.1
  Bottom Layer w0.254: H2.15 27.45,15.04 27.45,6.79 26.35,5.69 USB1.14 ; v1(18.5,9.62) v1(11.5,9.62) 11.5,6.52 USB1.13 3.65,5.69 2.81,6.53 2.81,15.42 1.92,16.31 H1.15
VIN: length 61.6
  Top Layer w0.254: 10.88,15.8 10.88,15.8 D1.1 ; v1(3.95,13.77) H1.16
  Top Layer w0.508: 12.7,16.44 12.7,15.05 v1(12.69,15.04) ; 12.7,16.44 12.06,15.8 10.88,15.8 10.88,17.52 9.5,18.89 C3.2 ; 12.7,16.44 U3.3
  Bottom Layer w0.254: v1(3.95,13.77) 4.88,14.7 4.88,16.15
  Bottom Layer w0.508: v1(12.69,15.04) 5.98,15.04 3.32,17.71 3.32,47.3 H1.2
0: length 47.2
  Top Layer w0.254: v1(26.3,21.52) 26.3,25.46 24.27,27.49 20.21,27.49 20.12,27.58 20.12,28.67 ; v1(24.4,9.62) 24.3,9.52 SW2.1 22,10.62 R8.1 ; H2.12 27.45,25.2 27.45,27.11 26.94,27.61 26.94,29.77 26.3,30.41 26.3,33.2 25.21,34.29 25.21,34.56 U1.25
  Bottom Layer w0.254: H2.12 26.18,21.39 26.18,9.87 25.92,9.62 v1(24.4,9.62)
2: length 58.1
  Top Layer w0.254: v1(11.5,21.12) 8.55,24.06 LED2.2 ; H2.13 28.72,21.77 27.06,23.42 27.06,26.85 26.56,27.36 26.56,29.65 25.79,30.41 25.79,33.2 24.78,34.22 21.15,34.22 U1.24 ; v1(26.81,20.76) 25.54,19.49 25.54,16.95 23.76,15.17 23.76,11.61 23.51,11.36 19.06,11.36 18.5,11.92 v1(18.5,21.12)
  Bottom Layer w0.254: v1(11.5,21.12) v1(18.5,21.12) ; H2.13 28.08,20.76 v1(26.81,20.76)
4: length 13.9
  Top Layer w0.254: H2.11 27.83,27.36 27.83,28.12 27.32,28.63 27.32,29.9 26.68,30.54 26.68,33.46 25.57,34.57 25.57,37.11 25.34,37.34 U1.26
5: length 10.6
  Top Layer w0.254: H2.8 26.68,36.12 26.68,40.7 26.23,41.15 U1.29
12: length 12.7
  Top Layer w0.254: U1.14 5.09,34.87 5.09,33.08 3.57,31.55 3.57,26.98 3.06,26.47 H1.11
14: length 18.1
  Top Layer w0.254: H1.12 3.95,26.6 3.95,31.3 5.47,32.82 5.47,34.47 6.11,35.11 7.53,35.11 7.78,35.36 7.78,36.87 7.31,37.34 U1.13
15: length 22.6
  Top Layer w0.254: U1.23 19.44,33.58 19.95,33.08 24.91,33.08 25.29,32.69 25.29,30.41 26.18,29.52 26.18,27.23 26.68,26.73 26.68,23.17 27.54,22.32 27.54,19.9 28.59,18.85 H2.14
16: length 12.8
  Top Layer w0.254: H2.10 27.06,30.66 27.06,33.71 25.92,34.85 25.92,38.28 25.59,38.61 U1.27
17: length 11.4
  Top Layer w0.254: H2.9 27.57,32.7 27.57,33.83 26.3,35.09 26.3,39.04 25.47,39.88 U1.28
18: length 9.6
  Top Layer w0.254: H2.7 27.06,38.28 27.06,41.97 26.61,42.42 U1.30
19: length 7.9
  Top Layer w0.254: U1.31 25.93,43.69 27.54,42.08 27.54,40.35 28.72,39.17
21: length 8.5
  Top Layer w0.254: U1.33 26.94,46.23 27.06,46.1 27.06,43.36 H2.5
22: length 5.3
  Top Layer w0.254: U1.36 28.01,50.04 H2.2
23: length 5.2
  Top Layer w0.254: H2.1 28.16,51.31 U1.37
25: length 15.5
  Top Layer w0.254: U1.10 5.42,41.15 4.71,40.44 4.71,33.46 3.06,31.81 3.06,29.39 2.68,29.01 H1.10
26: length 26.8
  Top Layer w0.254: U1.11 7.94,39.88 8.52,39.3 8.52,34.98 7.89,34.35 6.36,34.35 6.24,34.22 6.24,32.57 4.84,31.17 4.84,26.34 3.06,24.57 3.06,22.53 2.55,22.03 2.55,20.12 H1.14
27: length 22.5
  Top Layer w0.254: U1.12 7.69,38.61 8.14,38.16 8.14,35.11 7.76,34.73 6.24,34.73 5.86,34.35 5.86,32.69 4.46,31.3 4.46,26.47 2.68,24.69 2.68,22.79 H1.13
32: length 12.2
  Top Layer w0.254: U1.8 5.17,43.69 3.95,42.47 3.95,36.38 1.66,34.09
33: length 13.5
  Top Layer w0.254: U1.9 5.04,42.42 4.33,41.71 4.33,34.22 1.66,31.55
34: length 10.1
  Top Layer w0.254: U1.6 4.41,46.23 3.19,45.01 3.19,41.33 1.66,39.81 1.66,39.17
35: length 11.4
  Top Layer w0.254: 1.66,36.63 1.66,36.76 3.57,38.66 3.57,44.12 4.41,44.96 U1.7
D+: length 26
  Top Layer w0.254: v1(15.76,15.68) 16.02,15.93 16.02,25.71 v1(15.89,25.84) ; 15.76,7.17 15.76,6.25 USB1.8 ; 15.76,7.17 15.63,7.29 14.87,7.29 14.75,7.17 USB1.6 ; 15.76,7.17 v1(15.76,10.47) ; v1(14.11,25.84) 13.09,26.85 U2.5
  Bottom Layer w0.254: v1(15.76,10.47) v1(15.76,15.68) ; v1(15.89,25.84) v1(14.11,25.84)
D-: length 24.6
  Top Layer w0.254: v1(14.24,10.47) 14.24,9.97 14.25,9.96 USB1.5 14.25,4.77 v1(14.24,4.75) ; U2.6 12.71,25.58 13.73,24.57 13.73,16.18 v1(14.24,15.68) ; USB1.7 15.25,6.24 v1(15.25,4.75)
  Bottom Layer w0.254: v1(14.24,10.47) v1(14.24,15.68) ; v1(14.24,4.75) v1(15.25,4.75)
DTR: length 7
  Top Layer w0.254: U2.13 18.18,28.12 19.57,29.52 22.49,29.52 Q2.3 23.2,29 23.2,28.25
EN: length 76.9
  Top Layer w0.254: v1(9.54,17.45) v1(9.54,14.15) ; H1.3 4.53,50.04 U1.3 ; SW1.1 7.9,9.52 R1.2 ; SW1.1 6.9,12.9 7.54,13.54 ; SW1.1 5.7,9.52 v1(5.6,9.62)
  Bottom Layer w0.254: v1(9.54,14.15) 7.77,14.15 v1(7.54,13.92) ; H1.3 2.55,45.52 2.55,16.18 3.19,15.55 3.19,9.87 3.44,9.62 v1(5.6,9.62) ; v1(9.54,17.45) 6.87,17.45 5.66,18.66 5.66,29.33 5.85,29.52 v1(7.25,29.52)
RTS: length 12.8
  Top Layer w0.254: U2.14 17.33,29.94 v1(16.77,29.94) ; 6.8,28.25 7.56,28.25 9.88,30.57 10.52,30.57 11.06,30.03 13.14,30.03 v1(13.23,29.94)
  Bottom Layer w0.254: v1(16.77,29.94) 16.43,30.28 13.57,30.28 v1(13.23,29.94)
RXD: length 77.4
  Top Layer w0.254: U1.34 27.37,47.5 v1(27.45,47.43) 27.45,45.52 28.72,44.25
  Bottom Layer w0.254: v1(11.57,29.39) 9.93,29.39 9.16,30.15 5.98,30.15 5.09,29.27 5.09,18.47 6.62,16.95 6.62,16.82 24.53,16.82 25.16,17.45 25.16,22.03 26.81,23.68 26.81,46.79 v1(27.45,47.43)
SVN: length 9.3
  Top Layer w0.254: H1.5 1.66,41.71 2.81,42.85 2.81,46.03 4.28,47.5 U1.5
SVP: length 7.8
  Top Layer w0.254: U1.4 4.66,48.77 2.44,46.55 2.44,45.02 1.66,44.25 1.28,44.25
TXD: length 78.2
  Top Layer w0.254: U1.35 27.37,48.77 28.72,47.43 H2.3
  Bottom Layer w0.254: v1(11.57,30.66) 5.98,30.66 4.46,29.14 4.46,18.34 6.49,16.31 25.03,16.31 25.54,16.82 25.54,21.77 27.19,23.42 27.19,45.27 H2.3
$1N2818: length 2.4
  Top Layer w0.254: R2.2 13.25,7.42 13.75,6.92 USB1.4
$1N3069: length 11.2
  Top Layer w0.254: USB1.11 17.41,6.25 v1(17.41,7.29) ; D1.2 10.88,9 v1(12.59,7.29) 12.59,6.25 USB1.2
  Bottom Layer w0.254: v1(12.59,7.29) v1(17.41,7.29)
$1N3084: length 2.2
  Top Layer w0.254: R3.2 USB1.10
$1N3978: length 21.8
  Top Layer w0.254: R7.2 5.6,27.94 5.6,30.66 8.01,33.08 18.94,33.08 20.12,31.9 20.12,30.57
$1N4007: length 14.9
  Top Layer w0.254: 9.88,28.67 11.06,27.49 13.35,27.49 v1(14.11,26.73) ; v1(15.81,27.65) 16.68,27.65 16.84,27.49 18.94,27.49 19.69,26.74 R6.2
  Bottom Layer w0.254: v1(14.11,26.73) 14.89,26.73 v1(15.81,27.65)
$1N5108: length 6.1
  Top Layer w0.254: R4.1 6.83,21.33 LED1.1 LED2.1

Small or netless copper shapes (teardrops, artwork), in the pictures only: 4 on Top Layer, 110 on Bottom Layer

## Text on the board
Top Layer: EN | BOOT | GND | VIN | SVP | SVN | IO34 | IO35 | IO32 | IO33 | IO25 | IO12 | IO14 | IO27 | IO26 | IO23 | IO22 | TXD | RXD | IO21 | IO19 | IO18 | IO5 | IO17 | IO16 | IO4 | IO0 | IO2 | IO15 | 3.3V

# Board PCB3
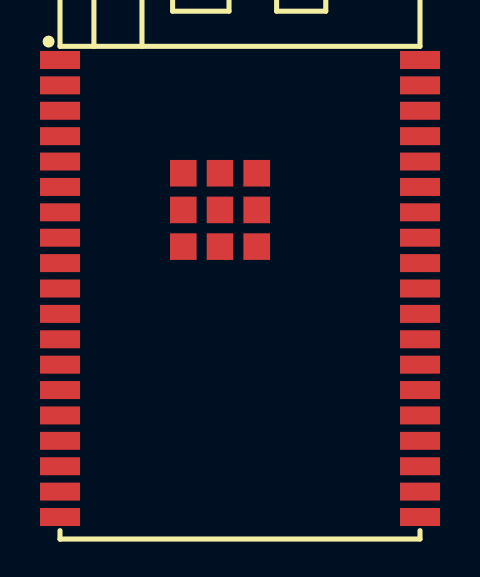
[diagram p7: board, top side]
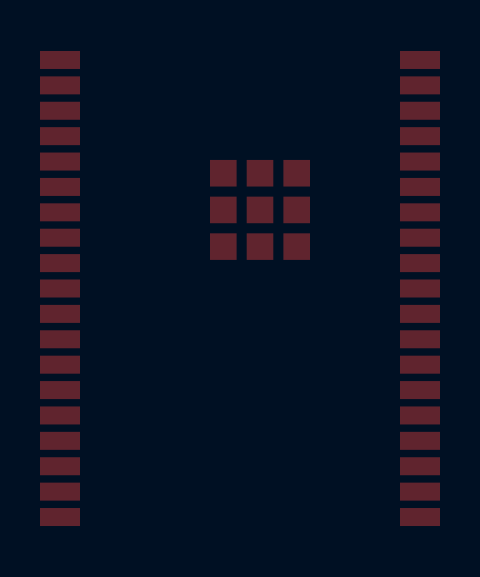
[diagram p8: board, bottom side, seen from below]

No outline. copper layers: Top Layer, Inner9, Inner10, Inner11, Inner12, Inner13, Inner14, Inner15, Inner16, Inner17, Inner18, Inner19, Inner20, Inner21, Inner22, Inner23, Inner24, Inner25, Inner26, Inner27, Inner28, Inner29, Inner30, Bottom Layer. Coordinates in mm from the lowest, leftmost part position.
Stack: Top Layer 0.035mm / Dielectric1 1.51mm FR4 er 4.5 / Bottom Layer 0.035mm

## Design rules (mm)
template: JLCPCB Capability(Two Layers Board)
spacing copperThickness1oz (default): track to track 0.102, other pairs 0.152 to 0.3
spacing copperThickness2oz: track to track 0.203, other pairs 0.152 to 0.3
track width copperThickness1oz (default): min 0.127, default 0.254, max 2.54
track width copperThickness2oz: min 0.203, default 0.254, max 2.54
differential pair differentialPair (default): width min 0.127, default 0.254, max 2.54; gap min 0.152, default 0.152
via viaSize (default): diameter min 0.5, default 0.61, max 10; hole min 0.3, default 0.305, max 6.3

## Placement (name value [footprint] x y rotation side)
U1  ESP32-WROVER-IE-N16R8  [WIFI-SMD_ESP32-WROVER-E]  0 0 0 top

## Footprints (pads in the part's own frame, mm; a bottom-side part is the same pattern mirrored in y, then rotated)
WIFI-SMD_ESP32-WROVER-E
  rect 2x0.9 smd: 1(-9,11.43) 2(-9,10.16) 3(-9,8.89) 4(-9,7.62) 5(-9,6.35) 6(-9,5.08) 7(-9,3.81) 8(-9,2.54) 9(-9,1.27) 10(-9,0) 11(-9,-1.27) 12(-9,-2.54) 13(-9,-3.81) 14(-9,-5.08) 15(-9,-6.35) 16(-9,-7.62) 17(-9,-8.89) 18(-9,-10.16) 19(-9,-11.43) 20(9,-11.43) 21(9,-10.16) 22(9,-8.89) 23(9,-7.62) 24(9,-6.35) 25(9,-5.08) 26(9,-3.81) 27(9,-2.54) 28(9,-1.27) 29(9,0) 30(9,1.27) 31(9,2.54) 32(9,3.81) 33(9,5.08) 34(9,6.35) 35(9,7.62) 36(9,8.89) 37(9,10.16) 38(9,11.43)
  rect 1.33x1.33 smd: 39(-2.835,5.765) 39(-2.835,3.93) 39(-2.835,2.095) 39(-1,5.765) 39(-1,3.93) 39(-1,2.095) 39(0.835,5.765) 39(0.835,3.93) 39(0.835,2.095)

## Nets
As in the schematic.

Pads without a net: U1 17 18 19 20 21 22 27 28 32

# Board PCB6
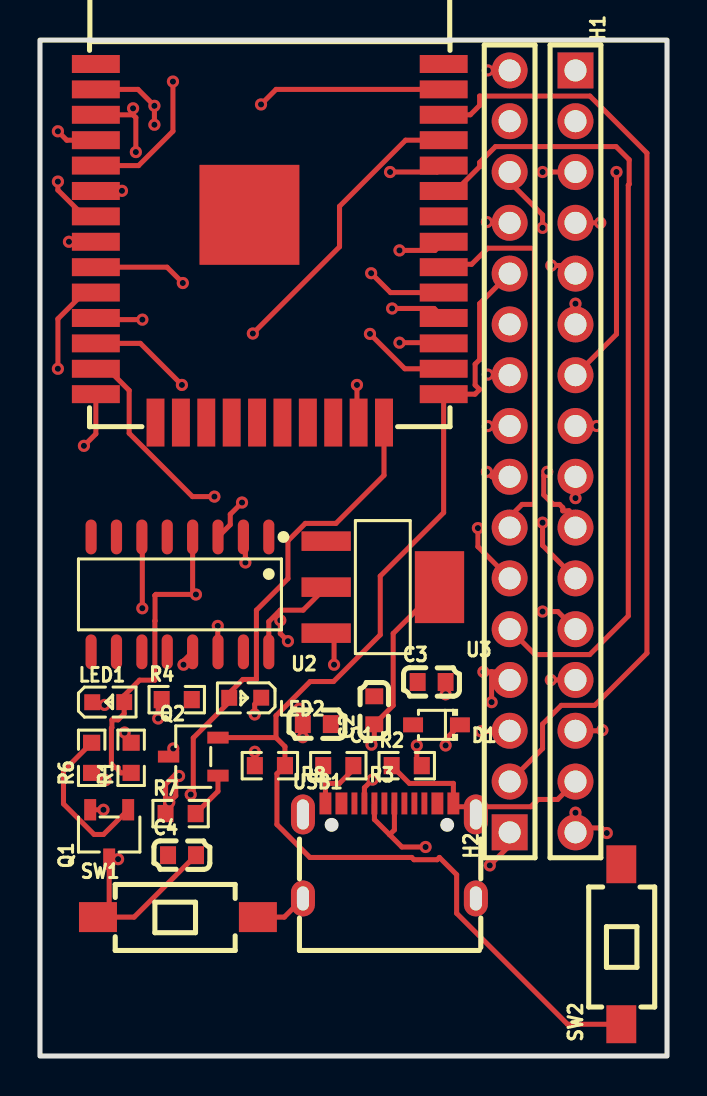
[diagram p9: board, top side]
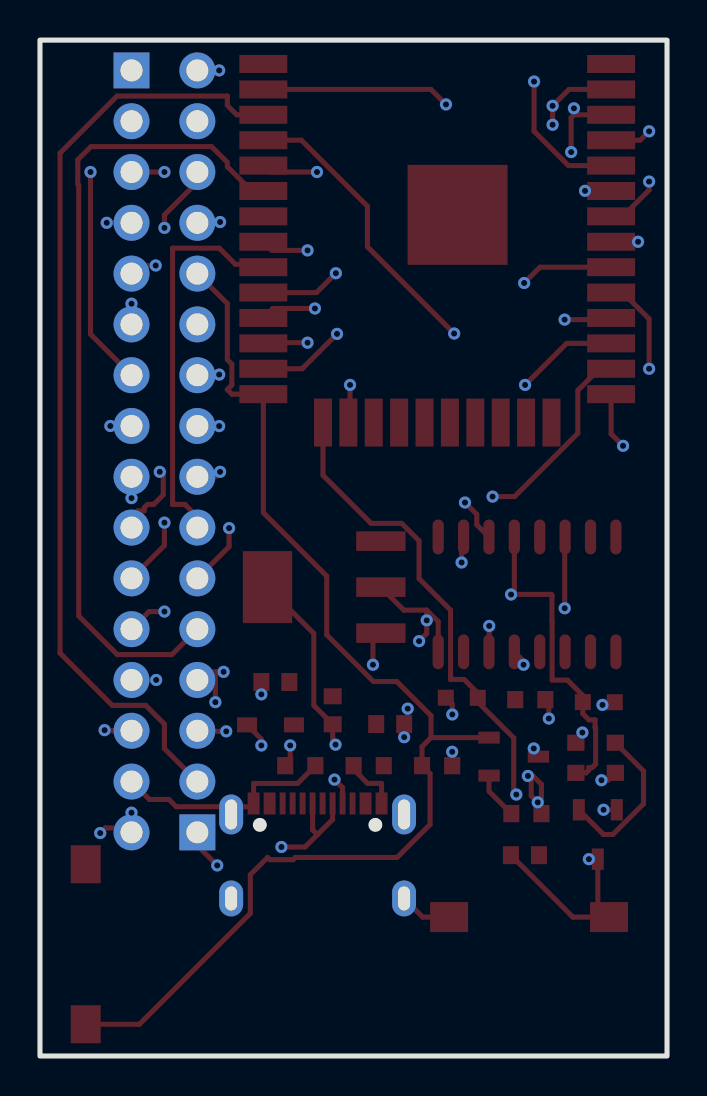
[diagram p10: board, bottom side, seen from below]

Outline 31.37 x 50.8 mm; copper layers: Top Layer, Inner1, Inner2, Inner3, Inner4, Bottom Layer. Coordinates in mm from the lower left corner of the outline.
Outline path: rectangle 0,50.8 31.37,0
Stack: Top Layer 0.035mm 外层铜厚1oz / Dielectric1 0.0994mm 3313 RC57% 4.2mil / Inner1 0.0152mm 内层铜厚 / Dielectric2 0.55mm 0.55mm H/H不含铜 / Inner2 0.0152mm 内层铜厚 / Dielectric3 0.1088mm 2116 RC54% 4.9mil / Inner3 0.0152mm 内层铜厚 / Dielectric4 0.55mm 0.55mm H/H不含铜 / Inner4 0.0152mm 内层铜厚 / Dielectric5 0.0994mm 3313 RC57% 4.2mil / Bottom Layer 0.035mm 外层铜厚1oz

## Design rules (mm)
template: JLCPCB Capability(Two Layers Board)
spacing copperThickness1oz (default): track to track 0.102, other pairs 0.152 to 0.3
spacing copperThickness2oz: track to track 0.203, other pairs 0.152 to 0.3
track width copperThickness1oz (default): min 0.127, default 0.254, max 2.54
track width copperThickness2oz: min 0.203, default 0.254, max 2.54
differential pair differentialPair (default): width min 0.127, default 0.254, max 2.54; gap min 0.152, default 0.152
via viaSize (default): diameter min 0.5, default 0.61, max 10; hole min 0.3, default 0.305, max 6.3

## Placement (name value [footprint] x y rotation side)
C1  100nF  [C0603]  13.85 16.6 180 top
C2  2.2uF  [C0603]  16.72 17.29 90 top
C3  10uF  [C0603]  19.59 18.7 0 top
C4  10uF  [C0603]  7.11 10.04 0 top
D1  1N5819WS  [SOD-323_L1.8-W1.3-LS2.5-RD]  19.84 16.56 180 top
H1  PZ254-1-16-Z-8.5  [HDR-TH_16P-P2.54-V-M]  26.79 30.23 270 top
H2  PZ254-1-16-Z-8.5  [HDR-TH_16P-P2.54-V-M]  23.5 30.23 90 top
LED1  0603  [LED0603-RD_RED]  3.41 17.69 0 top
LED2  0603  [LED0603-RD_RED]  10.27 17.91 180 top
Q1  S8050  [SOT-23-3_L2.9-W1.6-P1.90-LS2.8-BR]  3.46 11.08 90 top
Q2  S8050  [SOT-23-3_L2.9-W1.6-P1.90-LS2.8-BR]  7.67 14.97 0 top
R1  1K  [R0603]  4.56 14.91 90 top
R2  5.1K  [R0603]  18.35 14.52 0 top
R3  5.1K  [R0603]  14.92 14.52 180 top
R4  1K  [R0603]  6.84 17.82 0 top
R6  10K  [R0603]  2.59 14.91 90 top
R7  10K  [R0603]  7.04 12.12 0 top
R8  10K  [R0603]  11.5 14.52 180 top
SW1  TS-1101-C-W  [SW-SMD_L6.0-W3.3-LS8.0]  6.9 6.95 0 top
SW2  TS-1101-C-W  [SW-SMD_L6.0-W3.3-LS8.0]  29.08 5.59 90 top
U1  ESP32-WROOM-32-N8  [WIFIM-SMD_39P-L25.5-W18.0-P1.27]  11.5 40.64 0 top
U2  CH340C  [SOP-16_L10.0-W3.9-P1.27-LS6.0-BL]  7 23.08 180 top
U3  AMS1117-3.3  [SOT-223-4_L6.5-W3.5-P2.30-LS7.0-BR]  17.15 23.45 180 top
USB1  TYPE-C 16PIN 2MD(073)  [USB-C-SMD_TYPE-C-6PIN-2MD-073]  17.48 10.25 0 top

## Footprints (pads in the part's own frame, mm; a bottom-side part is the same pattern mirrored in y, then rotated)
C0603
  rect 0.8x0.9 smd: 1(-0.7,0) 2(0.7,0)
HDR-TH_16P-P2.54-V-M
  rect 1.8x1.8 hole 1.1: 1(-19.05,0)
  round 1.8 hole 1.1: 2(-16.51,0) 3(-13.97,0) 4(-11.43,0) 5(-8.89,0) 6(-6.35,0) 7(-3.81,0) 8(-1.27,0) 9(1.27,0) 10(3.81,0) 11(6.35,0) 12(8.89,0) 13(11.43,0) 14(13.97,0) 15(16.51,0) 16(19.05,0)
LED0603-RD_RED
  rect 0.8x0.8 smd: 1(-0.799,-0.004) 2(0.799,0.004)
R0603
  rect 0.806x0.864 smd: 1(-0.753,0) 2(0.753,0)
SOD-323_L1.8-W1.3-LS2.5-RD
  rect 1x0.75 smd: 1(-1.173,0) 2(1.173,0)
SOP-16_L10.0-W3.9-P1.27-LS6.0-BL
  oval 0.56x1.745 smd: 1(-4.445,-2.873) 2(-3.175,-2.873) 3(-1.905,-2.873) 4(-0.635,-2.873) 5(0.635,-2.873) 6(1.905,-2.873) 7(3.175,-2.873) 8(4.445,-2.873) 9(4.445,2.873) 10(3.175,2.873) 11(1.905,2.873) 12(0.635,2.873) 13(-0.635,2.873) 14(-1.905,2.873) 15(-3.175,2.873) 16(-4.445,2.873)
SOT-23-3_L2.9-W1.6-P1.90-LS2.8-BR
  rect 1.07x0.6 smd: 1(1.235,-0.95) 2(1.235,0.95) 3(-1.235,0)
SOT-223-4_L6.5-W3.5-P2.30-LS7.0-BR
  rect 2.47x0.98 smd: 1(2.835,-2.3) 2(2.835,0) 3(2.835,2.3)
  rect 2.47x3.6 smd: 4(-2.835,0)
SW-SMD_L6.0-W3.3-LS8.0
  rect 1.9x1.5 smd: 1(-4,0) 2(4,0)
USB-C-SMD_TYPE-C-6PIN-2MD-073
  rect 0.6x1.1 smd: 1(-3.2,2.375) 2(-2.4,2.375) 11(2.4,2.375) 12(3.2,2.375)
  rect 0.3x1.1 smd: 3(-1.75,2.375) 4(-1.25,2.375) 5(-0.75,2.375) 6(-0.25,2.375) 7(0.25,2.375) 8(0.75,2.375) 9(1.25,2.375) 10(1.75,2.375)
  oval 1.2x2 hole 0.6x1.5: 13(-4.325,1.825) 14(4.325,1.825)
  oval 1.2x1.8 hole 0.6x1.2: 13(-4.325,-2.375) 14(4.325,-2.375)
WIFIM-SMD_39P-L25.5-W18.0-P1.27
  rect 2.4x0.9 smd: 1(-8.7,8.965) 2(-8.7,7.695) 3(-8.7,6.425) 4(-8.7,5.155) 5(-8.7,3.885) 6(-8.7,2.615) 7(-8.7,1.345) 8(-8.7,0.075) 9(-8.7,-1.195) 10(-8.7,-2.465) 11(-8.7,-3.735) 12(-8.7,-5.005) 13(-8.7,-6.275) 14(-8.7,-7.545) 25(8.7,-7.545) 26(8.7,-6.275) 27(8.7,-5.005) 28(8.7,-3.735) 29(8.7,-2.465) 30(8.7,-1.195) 31(8.7,0.075) 32(8.7,1.345) 33(8.7,2.615) 34(8.7,3.885) 35(8.7,5.155) 36(8.7,6.425) 37(8.7,7.695) 38(8.7,8.965)
  rect 0.9x2.4 smd: 15(-5.715,-8.965) 16(-4.445,-8.965) 17(-3.175,-8.965) 18(-1.905,-8.965) 19(-0.635,-8.965) 20(0.635,-8.965) 21(1.905,-8.965) 22(3.175,-8.965) 23(4.445,-8.965) 24(5.715,-8.965)
  rect 5x5 smd: 39(-1.017,1.422)

## Nets
3.3V: C1.2 C2.1 H2.16 LED1.2 R1.1 R8.2 U1.2 U2.4 U2.16 U3.2 U3.4
GND: C1.1 C2.2 C3.1 C4.1 H1.1 H1.15 H2.15 R2.1 R3.1 R4.2 SW1.2 SW2.2 U1.1 U1.15 U1.38 U1.39 U2.1 U3.1 USB1.1 USB1.12 USB1.13 USB1.14
VIN: C3.2 D1.1 H1.2 H1.16 U3.3
0: H2.12 Q2.2 R8.1 SW2.1 U1.25
2: H2.13 LED2.2 U1.24
4: H2.11 U1.26
5: H2.8 U1.29
12: H1.11 U1.14
14: H1.12 U1.13
15: H2.14 U1.23
16: H2.10 U1.27
17: H2.9 U1.28
18: H2.7 U1.30
19: H2.6 U1.31
21: H2.5 U1.33
22: H2.2 U1.36
23: H2.1 U1.37
25: H1.10 U1.10
26: H1.14 U1.11
27: H1.13 U1.12
32: H1.8 U1.8
33: H1.9 U1.9
34: H1.6 U1.6
35: H1.7 U1.7
D+: U2.5 USB1.6 USB1.8
D-: U2.6 USB1.5 USB1.7
DTR: Q2.3 R6.1 U2.13
EN: C4.2 H1.3 Q1.3 R1.2 SW1.1 U1.3
RTS: Q1.2 R7.1 U2.14
RXD: H2.4 U1.34 U2.3
SVN: H1.5 U1.5
SVP: H1.4 U1.4
TXD: H2.3 U1.35 U2.2
$1N2818: R2.2 USB1.4
$1N3069: D1.2 USB1.2 USB1.11
$1N3084: R3.2 USB1.10
$1N3978: Q2.1 R7.2
$1N4007: Q1.1 R6.2
$1N5108: LED1.1 LED2.1 R4.1

Pads without a net: U1 16 17 18 19 20 21 22 32; U2 7 8 9 10 11 12 15; USB1 3 9

## Via types
v1: diameter 0.61, hole 0.305, Top Layer to Bottom Layer, 78 vias

## Routing (per net, layer and track width the routed paths; a pad name or vN(x,y) marks a point on that pad's centre or on a via; arc(x,y) is an arc through that point)
3.3V: length 100
  Top Layer w0.254: R1.1 4.05,14.16 3.91,14.29 3.91,14.43 3.74,14.43 3.57,14.6 3.57,16.39 3.6,16.42 3.6,16.81 3.91,16.81 4.21,17.12 LED1.2 4.21,18.03 4.98,18.79 5.75,18.79 5.75,21.75 5.76,21.76 5.76,23.02 5.75,23.03 5.8,23.08 7.64,23.08 ; v1(12.4,20.74) 12.02,21.13 v1(12.02,21.78) 12.02,22.3 ; U1.2 4.9,48.33 v1(5.72,47.51) v1(5.72,46.57) ; v1(13.15,15.94) C1.2 12.97,16.77 v1(12.97,17.37) ; U3.2 13.17,22.3 12.02,22.3 ; v1(22.41,49.28) H2.16 ; U3.4 17.67,21.13 17.67,17.53 C2.1 16.72,15.71 v1(16.58,15.57) ; 12.02,22.3 11.45,21.72 U2.16 ; 7.64,23.08 U2.4 ; 7.64,23.08 7.64,23.08 v1(7.8,23.08) ; v1(10.75,15.21) R8.2
  Inner1 w0.254: v1(16.58,15.57) 16.21,15.94 v1(13.15,15.94) ; v1(22.41,49.28) 16.19,49.28 15.23,48.33 7.41,48.33 7.17,48.09 6.13,48.09 5.9,48.33 5.87,48.33 5.72,48.18 v1(5.72,47.51) ; v1(10.75,15.21) 10.82,15.21 v1(12.97,17.37) ; v1(7.8,23.08) 7.8,21.78 8.84,20.74 v1(12.4,20.74)
  Inner2 w0.254: v1(12.02,21.78) 12.02,18.32 v1(12.97,17.37) ; v1(7.8,23.08) 7.8,44.49 v1(5.72,46.57)
GND: length 16.7
  Top Layer w0.254: H1.15 25.9,12.83 24.92,12.83 24.55,12.46 20.84,12.46 USB1.12 20.68,13.63 18.48,13.63 R2.1 ; R3.1 15.68,14.33 14.98,13.63 14.28,13.63 USB1.1 ; USB1.13 12.22,6.95 SW1.2
VIN: length 61
  Top Layer w0.254: v1(20.29,15.53) 20.29,15.84 D1.1 ; v1(28.36,11.15) 28.1,11.41 26.79,11.41 ; v1(26.79,12.17) 26.79,11.41 ; 26.79,11.41 H1.16 ; v1(20.29,18.09) C3.2 ; v1(14.71,19.56) 14.71,20.75 U3.3
  Inner1 w0.254: v1(20.29,18.09) 16.19,18.09 v1(14.71,19.56) ; v1(26.79,12.17) 26.37,12.17 25.14,13.39 25.14,14.06 24.21,14.99 20.83,14.99 v1(20.29,15.53)
  Inner2 w0.254: v1(28.36,11.15) 29.8,12.6 29.8,44.05 27.12,46.74 H1.2 ; v1(20.29,18.09) v1(20.29,15.53)
0: length 60
  Top Layer w0.254: 11.81,15.92 12.26,15.47 R8.1 11.85,14.12 11.85,11.58 13.5,9.93 18.6,9.93 18.71,9.82 19.87,9.82 19.98,9.93 20.84,9.07 20.84,7.13 26.39,1.59 SW2.1 ; 11.81,15.92 11.81,17.02 13.52,18.73 14.69,18.73 17.02,21.06 17.02,24 20.19,27.17 U1.25 21.77,33.09 22,33.32 21.77,33.55 21.77,34.6 22,34.82 22,37.62 H2.12 ; 11.81,15.92 8.9,15.92
2: length 69.9
  Top Layer w0.254: v1(22.36,41.7) 23.46,41.7 H2.13 ; U1.24 17.21,29.04 14.81,26.63 13.28,26.63 12.4,25.76 12.4,23.87 10.83,22.29 10.83,18.83 10.15,18.83 9.47,18.15 LED2.2 9.47,17.7 7.67,15.9 7.67,13.2 v1(7.54,13.07)
  Inner1 w0.254: v1(22.36,41.7) 9.38,41.7 6.38,38.7 6.38,17.6 6.55,17.43 6.55,16.33 6.24,16.01 6.03,16.01 6.03,14.74 6.37,14.74 6.37,14.73 6.35,14.73 6.32,14.7 6.32,13.48 6.49,13.32 7.1,13.32 7.1,13.13 7.29,12.94 7.41,12.94 v1(7.54,13.07)
4: length 11.6
  Top Layer w0.254: v1(16.51,36.11) 18.25,34.36 U1.26
  Inner1 w0.254: v1(16.51,36.11) 16.98,36.58 H2.11
5: length 17.7
  Top Layer w0.254: v1(16.57,39.14) 17.53,38.17 U1.29 ; H2.8 22.61,28.96 v1(22.36,29.21)
  Inner2 w0.254: v1(16.57,39.14) 16.67,39.14 19.78,36.02 19.78,31.79 v1(22.36,29.21)
12: length 30.9
  Top Layer w0.254: v1(2.2,30.51) 2.8,31.11 U1.14 ; H1.11 25.14,25.53 v1(25.14,26.67)
  Inner3 w0.254: v1(25.14,26.67) 25.14,26.76 24.21,27.69 12.48,27.69 9.67,30.51 v1(2.2,30.51)
14: length 32.1
  Top Layer w0.254: v1(8.73,27.97) 7.63,27.97 4.46,31.14 4.46,33.28 3.38,34.36 U1.13 ; v1(25.14,22.22) 25.91,22.22 H1.12
  Inner1 w0.254: v1(8.73,27.97) 8.73,25.41 11.53,22.61 24.75,22.61 v1(25.14,22.22)
15: length 21.1
  Top Layer w0.254: U1.23 15.86,31.76 v1(15.86,33.56) ; v1(25.14,41.41) 25.14,42.06 23.5,43.7 H2.14
  Inner1 w0.254: v1(25.14,41.41) 25.14,40.26 24.94,40.07 24.94,38.99 25.14,38.79 25.14,36.25 24.21,35.31 20.34,35.31 18.58,33.56 v1(15.86,33.56)
16: length 8.4
  Top Layer w0.254: v1(17.98,35.67) 20.16,35.67 U1.27 ; v1(22.41,34.07) 23.47,34.07 H2.10
  Inner3 w0.254: v1(22.41,34.07) 19.58,34.07 v1(17.98,35.67)
17: length 12.7
  Top Layer w0.254: H2.9 23.49,31.5 v1(22.41,31.5) ; v1(17.62,37.38) 19.72,37.38 U1.28
  Inner3 w0.254: v1(22.41,31.5) 21.34,31.5 17.25,35.58 17.25,37.02 v1(17.62,37.38)
18: length 19.8
  Top Layer w0.254: H2.7 23.5,26.96 24.12,27.58 24.74,27.58 24.74,40.39 22.4,40.39 21.59,39.59 20.34,39.59 U1.30
19: length 26.6
  Top Layer w0.254: H2.6 21.91,25.47 v1(21.91,26.4) ; U1.31 19.76,40.28 v1(17.98,40.28)
  Inner1 w0.254: v1(17.98,40.28) 16.89,40.28 12.29,35.68 21.58,26.4 v1(21.91,26.4)
21: length 40.7
  Top Layer w0.254: U1.33 20.78,43.25 22,44.47 22,44.68 22.78,45.47 28.82,45.47 29.48,44.82 29.48,43.59 29.43,43.54 29.43,22 27.5,20.07 24.77,20.07 H2.5
22: length 47.3
  Top Layer w0.254: H2.2 25.14,15.37 25.14,16.6 26.08,17.53 27.75,17.53 30.36,20.14 30.36,45.15 27.51,48 22,48 22,47.53 21.53,47.06 U1.36
23: length 56.1
  Top Layer w0.254: v1(11.06,47.58) 11.81,48.33 U1.37 ; H2.1 23.5,10.53 v1(22.5,9.53)
  Inner2 w0.254: v1(11.06,47.58) 14.89,43.75 14.89,21.74 17.49,19.14 17.49,11.44 19.4,9.53 v1(22.5,9.53)
25: length 35.4
  Top Layer w0.254: v1(0.9,34.36) 0.9,36.86 2.21,38.17 U1.10 ; H1.10 26.79,26.94 26.47,27.26 26.15,27.26 26.15,27.42 25.99,27.58 25.68,27.58 25.2,28.06 25.2,29.04 v1(25.38,29.21)
  Inner3 w0.254: v1(0.9,34.36) 12.37,34.36 16.5,30.23 24.35,30.23 v1(25.38,29.21)
26: length 48.1
  Top Layer w0.254: v1(28.14,16.29) 28.11,16.26 H1.14 ; U1.11 2.88,36.82 v1(5.12,36.82)
  Inner3 w0.254: v1(28.14,16.29) 28.14,30.69 28.31,30.87 28.49,30.87 28.49,32.14 28.31,32.14 28.14,32.31 28.14,35.31 21.78,35.31 18.84,38.26 8.64,38.26 7.2,36.82 v1(5.12,36.82)
27: length 39
  Top Layer w0.254: v1(7.1,33.56) 5.02,35.63 U1.12 ; v1(25.56,18.8) H1.13
  Inner1 w0.254: v1(7.1,33.56) 7.33,33.32 7.33,23.8 7.17,23.63 7.17,22.52 7.33,22.36 7.33,20.62 7.88,20.07 14.01,20.07 14.14,20.2 15.28,20.2 15.41,20.07 24.74,20.07 24.74,19.44 25.37,18.8 v1(25.56,18.8)
32: length 44
  Top Layer w0.254: v1(27.85,31.5) H1.8 ; U1.8 v1(1.45,40.71)
  Inner1 w0.254: v1(1.45,40.71) 3.22,42.49 3.22,43.2 4.53,44.5 11.02,44.5 12.59,42.93 27.57,42.93 29.43,41.08 29.43,33.08 v1(27.85,31.5)
33: length 42.8
  Top Layer w0.254: v1(7.15,38.65) 6.35,39.44 U1.9 ; v1(26.79,27.9) H1.9
  Inner1 w0.254: v1(7.15,38.65) 7.15,36.39 10.65,32.89 10.65,28.36 10.74,28.26 10.74,27.09 10.65,26.99 10.65,25.45 10.91,25.18 10.91,24.85 11.37,24.4 21.26,24.4 22.02,25.15 28.03,25.15 28.03,27.9 v1(26.79,27.9)
34: length 32.7
  Top Layer w0.254: v1(4.1,43.26) 2.8,43.26 U1.6 ; v1(26.79,37.62) H1.6
  Inner3 w0.254: v1(26.79,37.62) 28.04,37.62 29.43,39.01 28.04,40.39 20.17,40.39 17.3,43.26 v1(4.1,43.26)
35: length 43.4
  Top Layer w0.254: U1.7 2.21,41.98 0.9,43.3 v1(0.9,43.73) ; H1.7 28.84,36.09 v1(28.84,44.2)
  Inner1 w0.254: v1(28.84,44.2) 27.57,45.47 12.49,45.47 12.06,45.9 3.07,45.9 v1(0.9,43.73)
D-: length 33.7
  Top Layer w0.254: USB1.7 17.73,11.31 17.49,11.07 ; 17.49,11.07 18.11,10.45 v1(19.29,10.45) ; 17.49,11.07 16.73,11.83 USB1.5 ; v1(5.12,22.39) 5.12,25.93 U2.6
  Inner3 w0.254: v1(5.12,22.39) 5.12,13.22 7.89,10.45 v1(19.29,10.45)
DTR: length 21.2
  Top Layer w0.254: v1(7.18,19.56) 7.18,19.75 U2.13 ; v1(3.28,13.79) 2.95,13.79 R6.1 ; Q2.3 6.67,15.2 v1(6.67,15.38)
  Inner1 w0.254: v1(3.28,13.79) 3.12,13.79 1.62,12.29 3.12,10.79 6.52,10.79 9.14,13.41 7.18,15.38 ; 7.18,15.38 v1(6.67,15.38) ; 7.18,15.38 v1(7.18,19.56)
EN: length 76.8
  Top Layer w0.254: v1(25.14,44.2) H1.3 ; v1(4.8,45.2) 4.8,46.92 4.66,47.06 ; C4.2 4.71,6.95 3.46,6.95 ; v1(4.23,16.17) 4.56,15.85 R1.2 ; v1(4.66,47.39) 4.66,47.06 ; 4.66,47.06 U1.3 ; SW1.1 3.46,6.95 ; 3.46,6.95 Q1.3 v1(3.91,9.84)
  Inner2 w0.254: v1(4.66,47.39) 5.05,46.99 5.05,39.81 4.23,38.99 v1(4.23,16.17) 4.23,10.17 v1(3.91,9.84)
  Inner3 w0.254: v1(4.8,45.2) 11.04,45.2 11.8,45.97 11.8,46.74 19.77,46.74 21.04,45.47 24.21,45.47 25.14,44.54 v1(25.14,44.2)
RTS: length 17.6
  Top Layer w0.254: 6.79,14.09 6.79,13.01 v1(6.47,12.68) ; 6.79,14.09 6.87,14.09 v1(6.96,14) ; 6.79,14.09 6.28,13.58 R7.1 ; v1(8.9,21.51) 8.9,20.22 U2.14 ; Q1.2 v1(3.18,12.31)
  Inner1 w0.254: v1(6.47,12.68) 3.55,12.68 v1(3.18,12.31)
  Inner2 w0.254: v1(6.96,14) 8.9,15.94 v1(8.9,21.51)
RXD: length 55
  Top Layer w0.254: U2.3 9.52,26.57 9.52,27.09 v1(10.11,27.68) ; v1(17.51,44.2) 19.87,44.2 U1.34 ; 22.59,19.21 23.09,19.21 H2.4 ; 22.59,19.21 v1(22.59,17.69) ; 22.59,19.21 v1(22.18,19.21)
  Inner2 w0.254: v1(22.18,19.21) 22.18,23.02 16.92,28.28 16.92,34.68 15.56,36.04 15.56,42.25 v1(17.51,44.2)
  Inner3 w0.254: v1(22.59,17.69) 22.59,18.38 20.28,20.69 20.28,23.03 16.79,26.52 11.26,26.52 v1(10.11,27.68)
SVN: length 32.5
  Top Layer w0.254: H1.5 26.38,39.53 v1(25.58,39.53) ; v1(6.65,48.73) 6.65,46.24 4.93,44.52 U1.5
  Inner2 w0.254: v1(6.65,48.73) 16.77,48.73 20.93,44.56 20.93,42.25 22.78,40.39 24.72,40.39 v1(25.58,39.53)
SVP: length 33.9
  Top Layer w0.254: v1(0.9,46.24) 1.34,45.79 U1.4 ; v1(28.03,41.66) H1.4
  Inner3 w0.254: v1(28.03,41.66) 26.76,42.93 21.2,42.93 17.94,46.19 13.19,46.19 11.35,44.35 3.79,44.35 1.9,46.24 v1(0.9,46.24)
TXD: length 44.8
  Top Layer w0.254: v1(22.05,16.23) 23.47,16.23 H2.3 ; v1(10.28,24.68) 10.28,25.86 U2.2 ; v1(10.65,36.13) 14.99,40.46 14.99,42.49 18.29,45.79 U1.35
  Inner2 w0.254: v1(10.65,36.13) 10.94,35.84 10.94,25.34 v1(10.28,24.68)
  Inner3 w0.254: v1(10.28,24.68) 13.11,24.68 17.33,20.46 17.33,20.23 21.33,16.23 v1(22.05,16.23)
$1N2818: length 5.4
  Top Layer w0.254: v1(18.85,15.53) 18.85,14.77 R2.2 ; USB1.4 16.23,13.42 v1(16.64,13.82)
  Inner1 w0.254: v1(16.64,13.82) 17.15,13.82 v1(18.85,15.53)
$1N3978: length 2.4
  Top Layer w0.254: 8.9,14.02 8.9,13.24 R7.2
$1N4007: length 8
  Top Layer w0.254: R6.2 1.18,14.25 1.18,12.61 2.71,11.08 3.18,11.08 4.41,12.31
$1N5108: length 10.5
  Top Layer w0.254: LED1.1 2.75,17.56 v1(3.23,17.56) ; v1(10.74,17.08) 10.74,17.59 LED2.1 ; R4.1 5.91,17.64 v1(5.91,16.88)
  Inner1 w0.254: v1(3.23,17.56) 3.91,16.88 v1(5.91,16.88)
  Inner3 w0.254: v1(10.74,17.08) 10.54,16.88 v1(5.91,16.88)
